# EAGLE schematic ARE_adaptadores_v101 (EAGLE 6.1)

## Sheet 1 of 11: dsPIC / 24F / PIC32 64pin
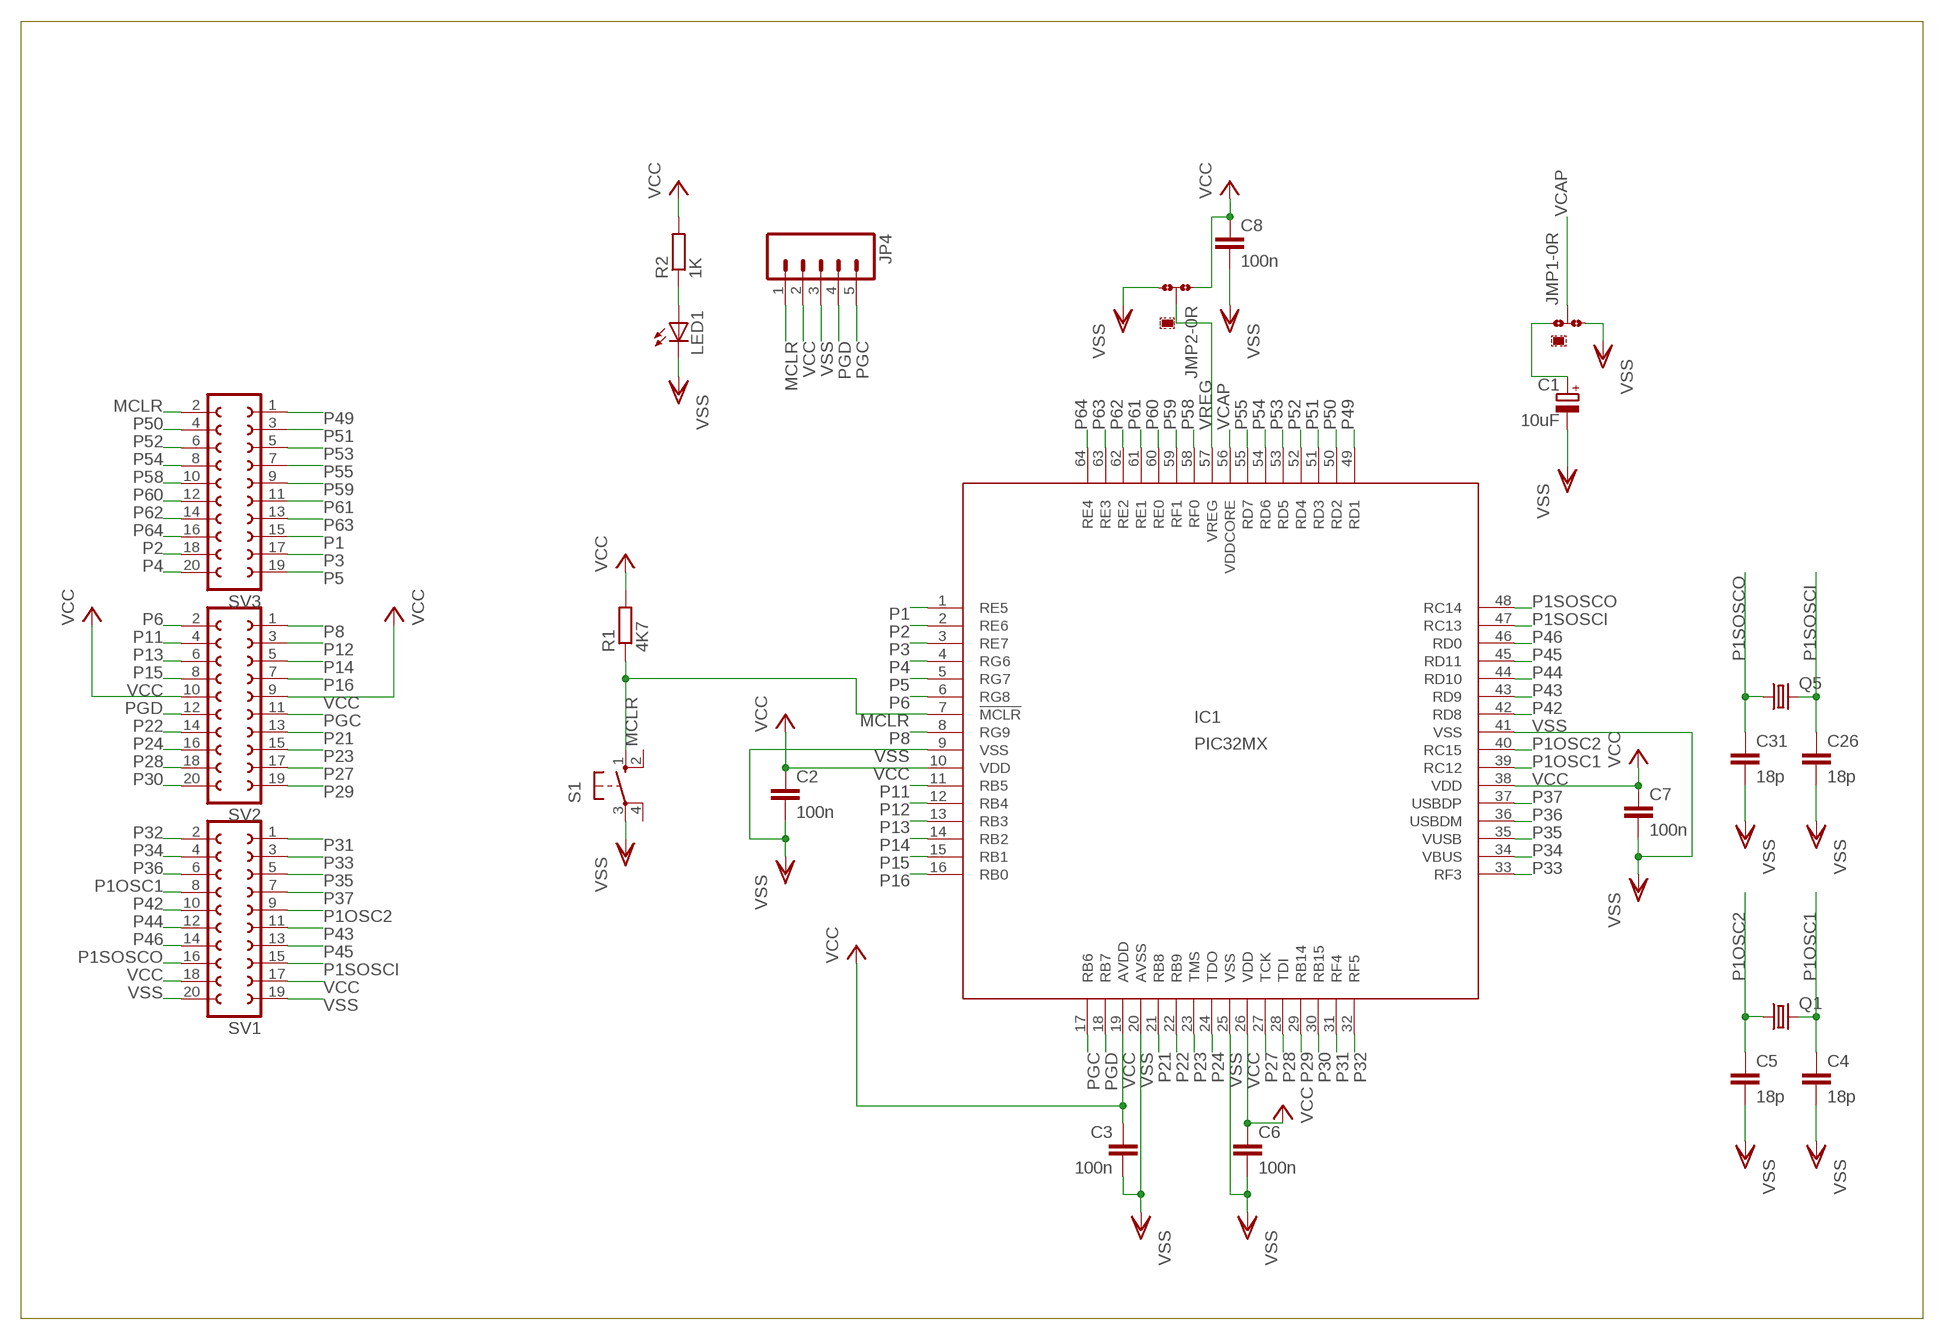
[diagram p0: schematic, sheet 1]

### Parts
C1  10uF  CPOL-EUSMCC  [SMC_C]
C2  100n  C-EUC0805  [C0805]
C3  100n  C-EUC0805  [C0805]
C4  18p  C-EUC0805  [C0805]
C5  18p  C-EUC0805  [C0805]
C6  100n  C-EUC0805  [C0805]
C7  100n  C-EUC0805  [C0805]
C8  100n  C-EUC0805  [C0805]
C26  18p  C-EUC0805  [C0805]
C31  18p  C-EUC0805  [C0805]
IC1  PIC32MX  PIC32MX440F256H  [TQFP64-10X10]
JMP1  0R-JUMPA  [A0R-JMP]
JMP2  0R-JUMPA  [A0R-JMP]
JP4  M05PTH  [1X05]
LED1  LEDCHIPLED_0805  [CHIPLED_0805]
Q1  CRYSTALHC18U-V  [HC18U-V]
Q5  CRYSTALHC18U-V  [HC18U-V]
R1  4K7  R-EU_R0805  [R0805]
R2  1K  R-EU_R0805  [R0805]
S1  10-XX  [B3F-10XX]
SV1  FE10-2W  [FE10-2W]
SV2  FE10-2W  [FE10-2W]
SV3  FE10-2W  [FE10-2W]

### Nets
MCLR: IC1.7(!MCLR) JP4.1 R1.1 S1.1(S) SV3.2
N$1: LED1.A R2.1
N$5: C1.+ JMP1.1
P1: IC1.1(RE5) SV3.15
P1OSC1: C4.1 IC1.39(RC12) Q1.2 SV1.8
P1OSC2: C5.1 IC1.40(RC15) Q1.1 SV1.9
P1SOSCI: C26.1 IC1.47(RC13) Q5.2 SV1.15
P1SOSCO: C31.1 IC1.48(RC14) Q5.1 SV1.16
P2: IC1.2(RE6) SV3.18
P3: IC1.3(RE7) SV3.17
P4: IC1.4(RG6) SV3.20
P5: IC1.5(RG7) SV3.19
P6: IC1.6(RG8) SV2.2
P8: IC1.8(RG9) SV2.1
P11: IC1.11(RB5) SV2.4
P12: IC1.12(RB4) SV2.3
P13: IC1.13(RB3) SV2.6
P14: IC1.14(RB2) SV2.5
P15: IC1.15(RB1) SV2.8
P16: IC1.16(RB0) SV2.7
P21: IC1.21(RB8) SV2.13
P22: IC1.22(RB9) SV2.14
P23: IC1.23(TMS) SV2.15
P24: IC1.24(TDO) SV2.16
P27: IC1.27(TCK) SV2.17
P28: IC1.28(TDI) SV2.18
P29: IC1.29(RB14) SV2.19
P30: IC1.30(RB15) SV2.20
P31: IC1.31(RF4) SV1.1
P32: IC1.32(RF5) SV1.2
P33: IC1.33(RF3) SV1.3
P34: IC1.34(VBUS) SV1.4
P35: IC1.35(VUSB) SV1.5
P36: IC1.36(USBDM) SV1.6
P37: IC1.37(USBDP) SV1.7
P42: IC1.42(RD8) SV1.10
P43: IC1.43(RD9) SV1.11
P44: IC1.44(RD10) SV1.12
P45: IC1.45(RD11) SV1.13
P46: IC1.46(RD0) SV1.14
P49: IC1.49(RD1) SV3.1
P50: IC1.50(RD2) SV3.4
P51: IC1.51(RD3) SV3.3
P52: IC1.52(RD4) SV3.6
P53: IC1.53(RD5) SV3.5
P54: IC1.54(RD6) SV3.8
P55: IC1.55(RD7) SV3.7
P58: IC1.58(RF0) SV3.10
P59: IC1.59(RF1) SV3.9
P60: IC1.60(RE0) SV3.12
P61: IC1.61(RE1) SV3.11
P62: IC1.62(RE2) SV3.14
P63: IC1.63(RE3) SV3.13
P64: IC1.64(RE4) SV3.16
PGC: IC1.17(RB6) JP4.5 SV2.11
PGD: IC1.18(RB7) JP4.4 SV2.12
VCAP: IC1.56(VDDCORE) JMP1.2
VCC: C2.1 C3.1 C6.1 C7.1 C8.1 IC1.10(VDD) IC1.19(AVDD) IC1.26(VDD) IC1.38(VDD) JMP2.1 JP4.2 R1.2 R2.2 SV1.17 SV1.18 SV2.9 SV2.10 ; also sheet 2,3,4,5,6
VREG: IC1.57(VREG) JMP2.2
VSS: C1.- C2.2 C3.2 C4.2 C5.2 C6.2 C7.2 C8.2 C26.2 C31.2 IC1.9(VSS) IC1.20(AVSS) IC1.25(VSS) IC1.41(VSS) JMP1.3 JMP2.3 JP4.3 LED1.C S1.3(P) SV1.19 SV1.20 ; also sheet 2,3,4,5,6,7,8,9,10,11
Unconnected: S1.2(S1) S1.4(P1)

## Sheet 2 of 11: dsPIC / 24F / PIC32 44 pin
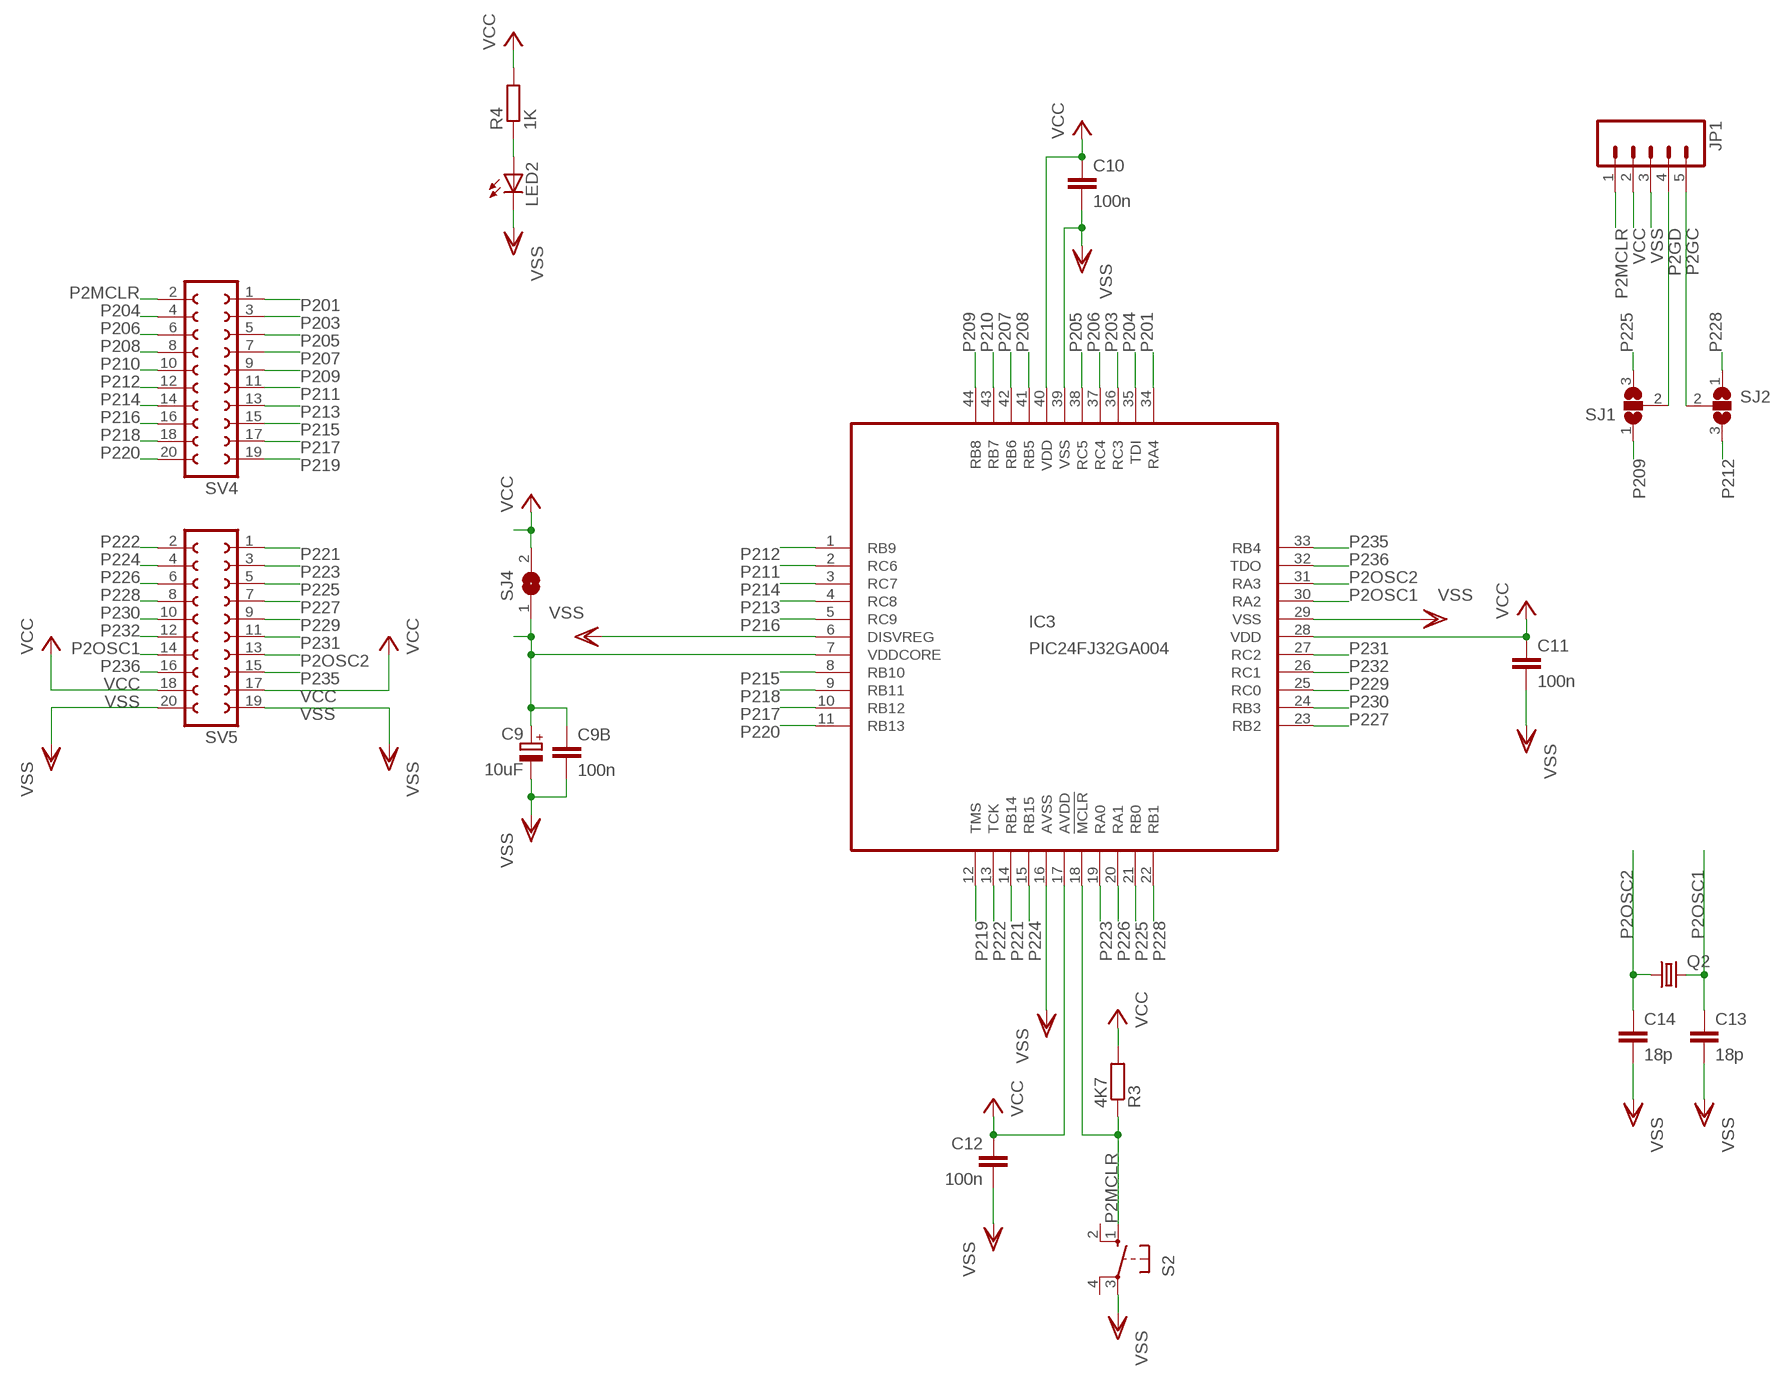
[diagram p1: schematic, sheet 2]

### Parts
C9  10uF  CPOL-EUSMCC  [SMC_C]
C9B  100n  C-EUC0805  [C0805]
C10  100n  C-EUC0805  [C0805]
C11  100n  C-EUC0805  [C0805]
C12  100n  C-EUC0805  [C0805]
C13  18p  C-EUC0805  [C0805]
C14  18p  C-EUC0805  [C0805]
IC3  PIC24FJ32GA004  [TQFP44]
JP1  M05PTH  [1X05]
LED2  LEDCHIPLED_0805  [CHIPLED_0805]
Q2  CRYSTALHC18U-V  [HC18U-V]
R3  4K7  R-EU_R0805  [R0805]
R4  1K  R-EU_R0805  [R0805]
S2  10-XX  [B3F-10XX]
SJ1  SJ2W  [SJ_2]
SJ2  SJ2W  [SJ_2]
SJ4  SJ  [SJ]
SV4  FE10-2W  [FE10-2W]
SV5  FE10-2W  [FE10-2W]

### Nets
N$2: LED2.A R4.1
N$11: C9.+ C9B.1 IC3.7(VDDCORE) SJ4.1
P2GC: JP1.5 SJ2.2
P2GD: JP1.4 SJ1.2
P2MCLR: IC3.18(!MCLR) JP1.1 R3.1 S2.1(S) SV4.2
P2OSC1: C13.1 IC3.30(RA2) Q2.2 SV5.14
P2OSC2: C14.1 IC3.31(RA3) Q2.1 SV5.13
P201: IC3.34(RA4) SV4.1
P203: IC3.36(RC3) SV4.3
P204: IC3.35(TDI) SV4.4
P205: IC3.38(RC5) SV4.5
P206: IC3.37(RC4) SV4.6
P207: IC3.42(RB6) SV4.7
P208: IC3.41(RB5) SV4.8
P209: IC3.44(RB8) SJ1.1 SV4.9
P210: IC3.43(RB7) SV4.10
P211: IC3.2(RC6) SV4.11
P212: IC3.1(RB9) SJ2.3 SV4.12
P213: IC3.4(RC8) SV4.13
P214: IC3.3(RC7) SV4.14
P215: IC3.8(RB10) SV4.15
P216: IC3.5(RC9) SV4.16
P217: IC3.10(RB12) SV4.17
P218: IC3.9(RB11) SV4.18
P219: IC3.12(TMS) SV4.19
P220: IC3.11(RB13) SV4.20
P221: IC3.14(RB14) SV5.1
P222: IC3.13(TCK) SV5.2
P223: IC3.19(RA0) SV5.3
P224: IC3.15(RB15) SV5.4
P225: IC3.21(RB0) SJ1.3 SV5.5
P226: IC3.20(RA1) SV5.6
P227: IC3.23(RB2) SV5.7
P228: IC3.22(RB1) SJ2.1 SV5.8
P229: IC3.25(RC0) SV5.9
P230: IC3.24(RB3) SV5.10
P231: IC3.27(RC2) SV5.11
P232: IC3.26(RC1) SV5.12
P235: IC3.33(RB4) SV5.15
P236: IC3.32(TDO) SV5.16
VCC: C10.1 C11.1 C12.1 IC3.17(AVDD) IC3.28(VDD) IC3.40(VDD) JP1.2 R3.2 R4.2 SJ4.2 SV5.17 SV5.18 ; also sheet 1,3,4,5,6
VSS: C9.- C9B.2 C10.2 C11.2 C12.2 C13.2 C14.2 IC3.6(DISVREG) IC3.16(AVSS) IC3.29(VSS) IC3.39(VSS) JP1.3 LED2.C S2.3(P) SV5.19 SV5.20 ; also sheet 1,3,4,5,6,7,8,9,10,11
Unconnected: S2.2(S1) S2.4(P1)

## Sheet 3 of 11: dsPIC 28pin
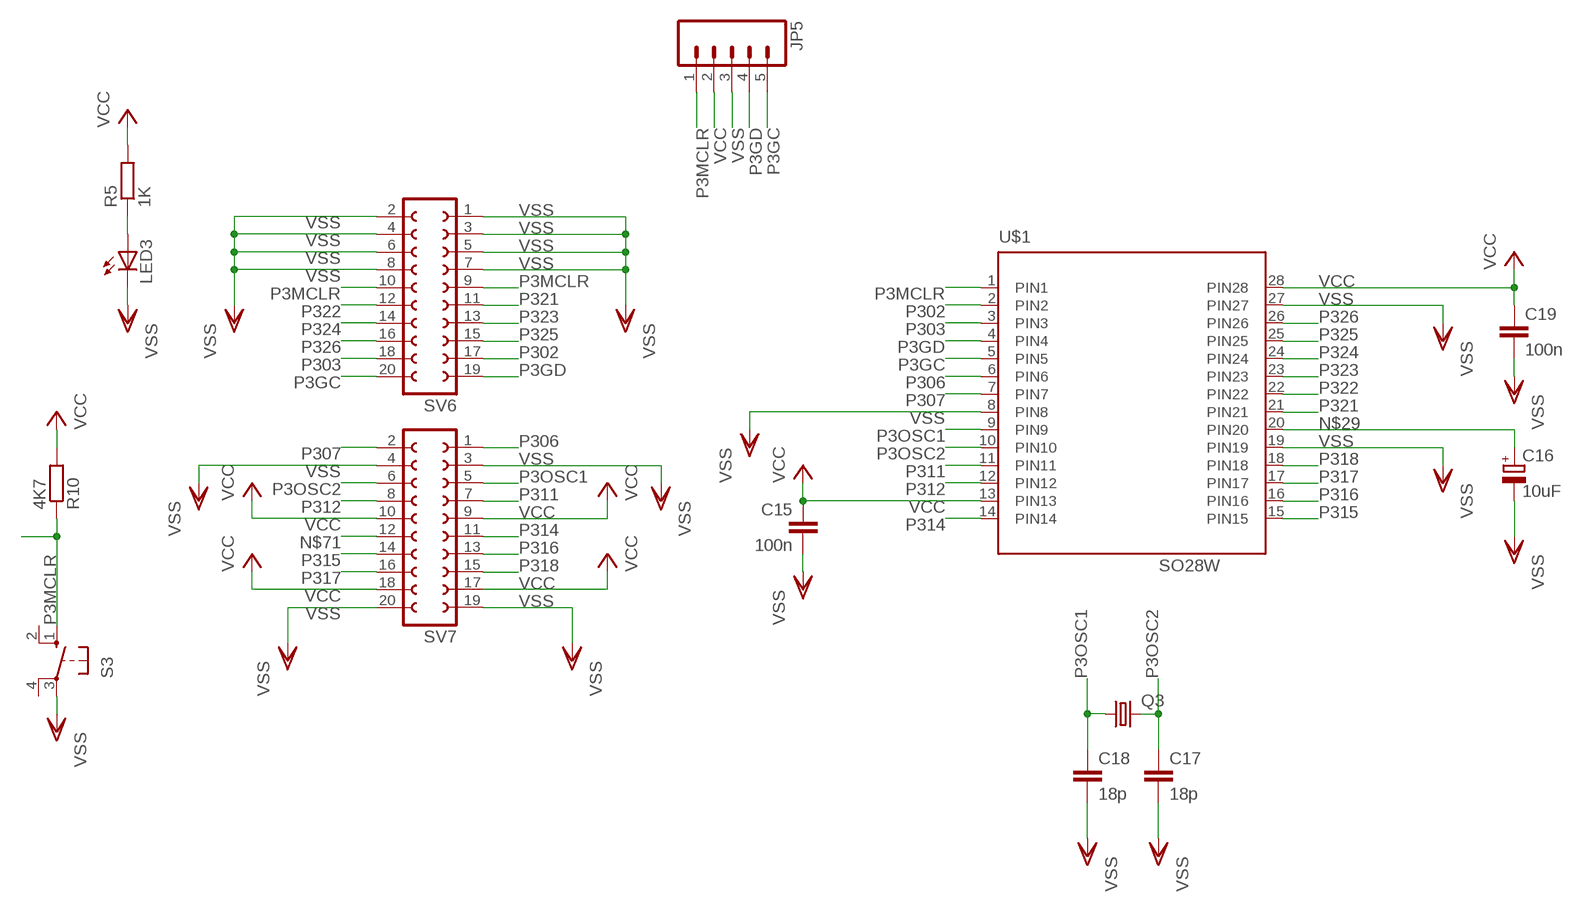
[diagram p2: schematic, sheet 3]

### Parts
C15  100n  C-EUC0805  [C0805]
C16  10uF  CPOL-EUSMCC  [SMC_C]
C17  18p  C-EUC0805  [C0805]
C18  18p  C-EUC0805  [C0805]
C19  100n  C-EUC0805  [C0805]
JP5  M05PTH  [1X05]
LED3  LEDCHIPLED_0805  [CHIPLED_0805]
Q3  CRYSTALHC18U-V  [HC18U-V]
R5  1K  R-EU_R0805  [R0805]
R10  4K7  R-EU_R0805  [R0805]
S3  10-XX  [B3F-10XX]
SV6  FE10-2W  [FE10-2W]
SV7  FE10-2W  [FE10-2W]
U$1  SO28W  [SO28W]

### Nets
N$3: LED3.A R5.1
N$29: C16.+ U$1.20(PIN20)
N$71: SV7.12
P3GC: JP5.5 SV6.20 U$1.5(PIN5)
P3GD: JP5.4 SV6.19 U$1.4(PIN4)
P3MCLR: JP5.1 R10.1 S3.1(S) SV6.9 SV6.10 U$1.1(PIN1)
P3OSC1: C18.1 Q3.1 SV7.5 U$1.9(PIN9)
P3OSC2: C17.1 Q3.2 SV7.6 U$1.10(PIN10)
P302: SV6.17 U$1.2(PIN2)
P303: SV6.18 U$1.3(PIN3)
P306: SV7.1 U$1.6(PIN6)
P307: SV7.2 U$1.7(PIN7)
P311: SV7.7 U$1.11(PIN11)
P312: SV7.8 U$1.12(PIN12)
P314: SV7.11 U$1.14(PIN14)
P315: SV7.14 U$1.15(PIN15)
P316: SV7.13 U$1.16(PIN16)
P317: SV7.16 U$1.17(PIN17)
P318: SV7.15 U$1.18(PIN18)
P321: SV6.11 U$1.21(PIN21)
P322: SV6.12 U$1.22(PIN22)
P323: SV6.13 U$1.23(PIN23)
P324: SV6.14 U$1.24(PIN24)
P325: SV6.15 U$1.25(PIN25)
P326: SV6.16 U$1.26(PIN26)
VCC: C15.1 C19.1 JP5.2 R5.2 R10.2 SV7.9 SV7.10 SV7.17 SV7.18 U$1.13(PIN13) U$1.28(PIN28) ; also sheet 1,2,4,5,6
VSS: C15.2 C16.- C17.2 C18.2 C19.2 JP5.3 LED3.C S3.3(P) SV6.1 SV6.2 SV6.3 SV6.4 SV6.5 SV6.6 SV6.7 SV6.8 SV7.3 SV7.4 SV7.19 SV7.20 U$1.8(PIN8) U$1.19(PIN19) U$1.27(PIN27) ; also sheet 1,2,4,5,6,7,8,9,10,11
Unconnected: S3.2(S1) S3.4(P1)

## Sheet 4 of 11: PIC 16F / 18F 44 pin
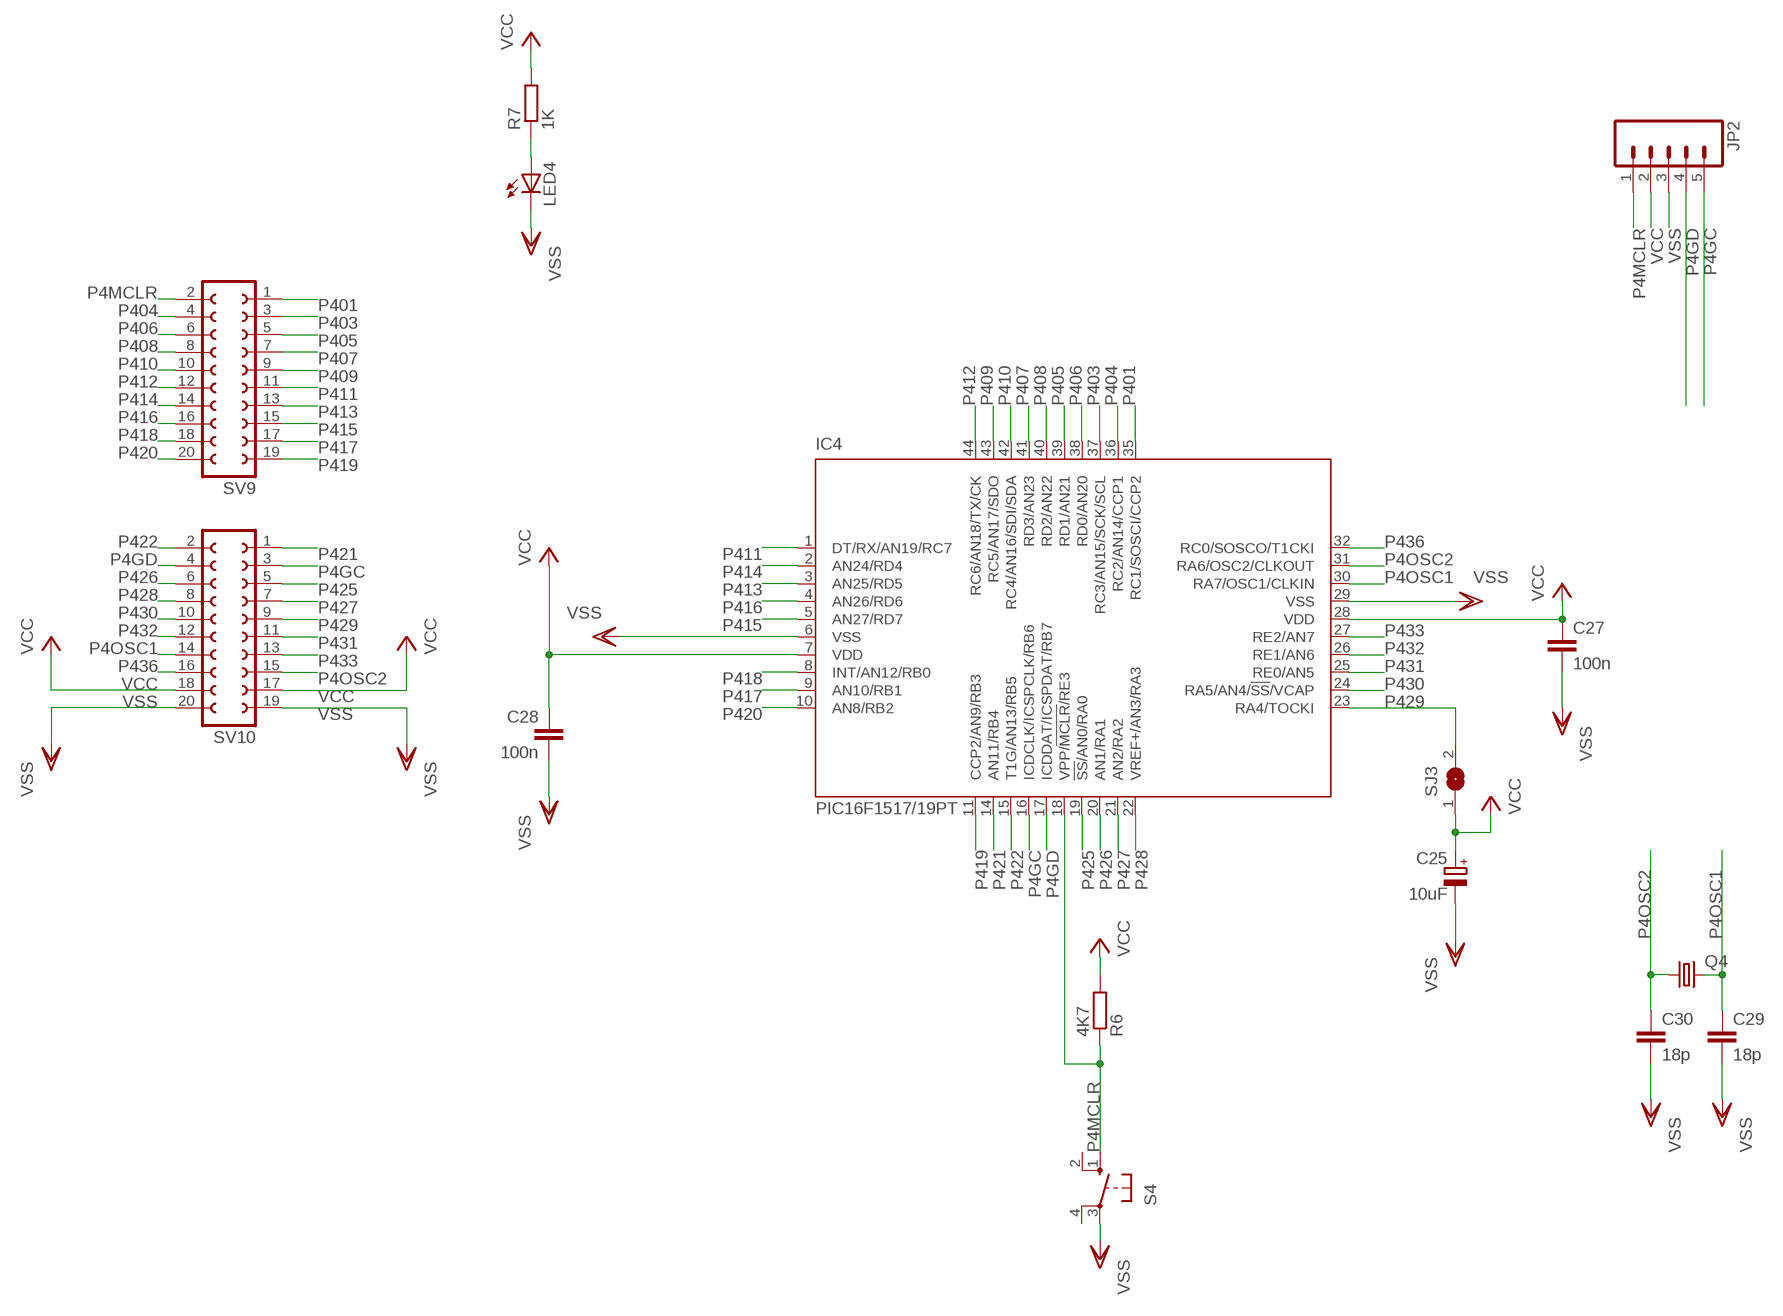
[diagram p3: schematic, sheet 4]

### Parts
C25  10uF  CPOL-EUSMCC  [SMC_C]
C27  100n  C-EUC0805  [C0805]
C28  100n  C-EUC0805  [C0805]
C29  18p  C-EUC0805  [C0805]
C30  18p  C-EUC0805  [C0805]
IC4  PIC16F1517/19PT  [TQFP44]
JP2  M05PTH  [1X05]
LED4  LEDCHIPLED_0805  [CHIPLED_0805]
Q4  CRYSTALHC18U-V  [HC18U-V]
R6  4K7  R-EU_R0805  [R0805]
R7  1K  R-EU_R0805  [R0805]
S4  10-XX  [B3F-10XX]
SJ3  SJ  [SJ]
SV9  FE10-2W  [FE10-2W]
SV10  FE10-2W  [FE10-2W]

### Nets
N$4: LED4.A R7.1
P4GC: IC4.16(ICDCLK/ICSPCLK/RB6) JP2.5 SV10.3
P4GD: IC4.17(ICDDAT/ICSPDAT/RB7) JP2.4 SV10.4
P4MCLR: IC4.18(VPP/!MCLR!/RE3) JP2.1 R6.1 S4.1(S) SV9.2
P4OSC1: C29.1 IC4.30(RA7/OSC1/CLKIN) Q4.2 SV10.14
P4OSC2: C30.1 IC4.31(RA6/OSC2/CLKOUT) Q4.1 SV10.15
P401: IC4.35(RC1/SOSCI/CCP2) SV9.1
P403: IC4.37(RC3/AN15/SCK/SCL) SV9.3
P404: IC4.36(RC2/AN14/CCP1) SV9.4
P405: IC4.39(RD1/AN21) SV9.5
P406: IC4.38(RD0/AN20) SV9.6
P407: IC4.41(RD3/AN23) SV9.7
P408: IC4.40(RD2/AN22) SV9.8
P409: IC4.43(RC5/AN17/SDO) SV9.9
P410: IC4.42(RC4/AN16/SDI/SDA) SV9.10
P411: IC4.1(DT/RX/AN19/RC7) SV9.11
P412: IC4.44(RC6/AN18/TX/CK) SV9.12
P413: IC4.3(AN25/RD5) SV9.13
P414: IC4.2(AN24/RD4) SV9.14
P415: IC4.5(AN27/RD7) SV9.15
P416: IC4.4(AN26/RD6) SV9.16
P417: IC4.9(AN10/RB1) SV9.17
P418: IC4.8(INT/AN12/RB0) SV9.18
P419: IC4.11(CCP2/AN9/RB3) SV9.19
P420: IC4.10(AN8/RB2) SV9.20
P421: IC4.14(AN11/RB4) SV10.1
P422: IC4.15(T1G/AN13/RB5) SV10.2
P425: IC4.19(!SS!/AN0/RA0) SV10.5
P426: IC4.20(AN1/RA1) SV10.6
P427: IC4.21(AN2/RA2) SV10.7
P428: IC4.22(VREF+/AN3/RA3) SV10.8
P429: IC4.23(RA4/TOCKI) SJ3.2 SV10.9
P430: IC4.24(RA5/AN4/!SS!/VCAP) SV10.10
P431: IC4.25(RE0/AN5) SV10.11
P432: IC4.26(RE1/AN6) SV10.12
P433: IC4.27(RE2/AN7) SV10.13
P436: IC4.32(RC0/SOSCO/T1CKI) SV10.16
VCC: C25.+ C27.1 C28.1 IC4.7(VDD) IC4.28(VDD) JP2.2 R6.2 R7.2 SJ3.1 SV10.17 SV10.18 ; also sheet 1,2,3,5,6
VSS: C25.- C27.2 C28.2 C29.2 C30.2 IC4.6(VSS) IC4.29(VSS) JP2.3 LED4.C S4.3(P) SV10.19 SV10.20 ; also sheet 1,2,3,5,6,7,8,9,10,11
Unconnected: S4.2(S1) S4.4(P1)

## Sheet 5 of 11: PIC 10F / 12F / 16F 8pin / 14pin
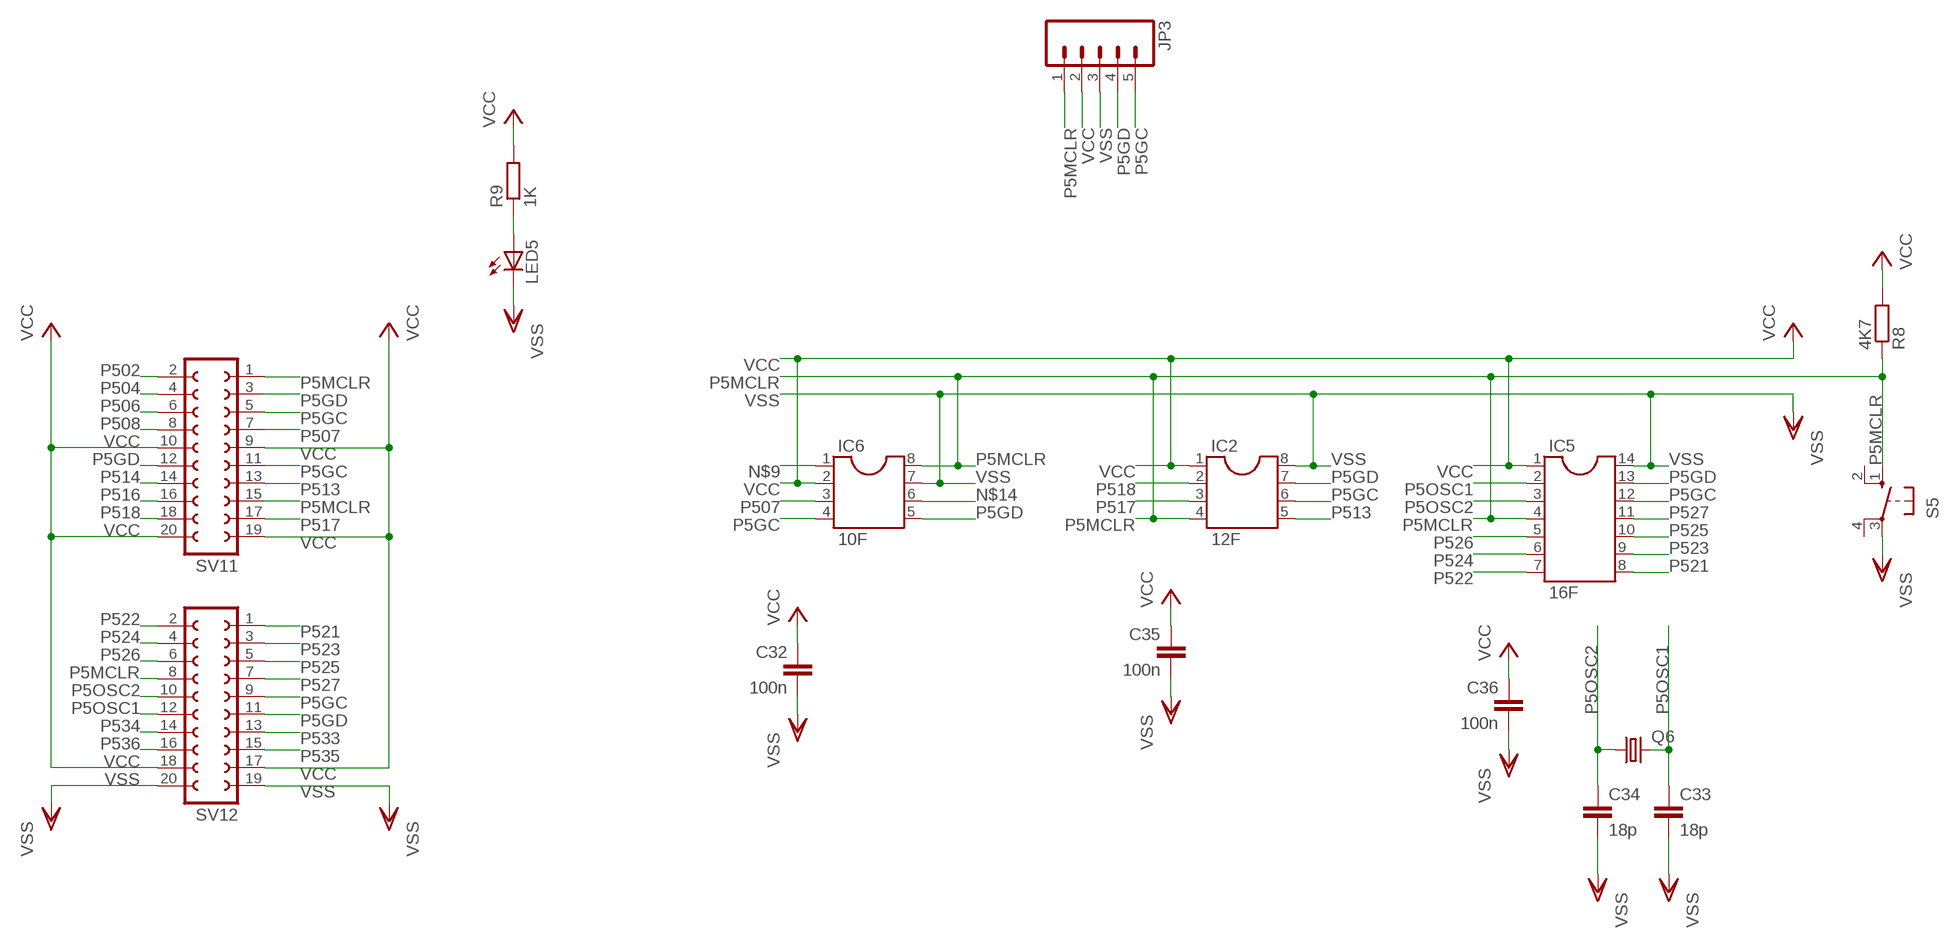
[diagram p4: schematic, sheet 5]

### Parts
C32  100n  C-EUC0805  [C0805]
C33  18p  C-EUC0805  [C0805]
C34  18p  C-EUC0805  [C0805]
C35  100n  C-EUC0805  [C0805]
C36  100n  C-EUC0805  [C0805]
IC2  12F  DIL8S  [SOCKET-08]
IC5  16F  DIL14S  [SOCKET-14]
IC6  10F  DIL8S  [SOCKET-08]
JP3  M05PTH  [1X05]
LED5  LEDCHIPLED_0805  [CHIPLED_0805]
Q6  CRYSTALHC18U-V  [HC18U-V]
R8  4K7  R-EU_R0805  [R0805]
R9  1K  R-EU_R0805  [R0805]
S5  10-XX  [B3F-10XX]
SV11  FE10-2W  [FE10-2W]
SV12  FE10-2W  [FE10-2W]

### Nets
N$8: LED5.A R9.1
N$9: IC6.1
N$14: IC6.6
P5GC: IC2.6 IC5.12 IC6.4 JP3.5 SV11.5 SV11.11 SV12.9
P5GD: IC2.7 IC5.13 IC6.5 JP3.4 SV11.3 SV11.12 SV12.11
P5MCLR: IC2.4 IC5.4 IC6.8 JP3.1 R8.1 S5.1(S) SV11.1 SV11.15 SV12.8
P5OSC1: C33.1 IC5.2 Q6.2 SV12.12
P5OSC2: C34.1 IC5.3 Q6.1 SV12.10
P502: SV11.2
P504: SV11.4
P506: SV11.6
P507: IC6.3 SV11.7
P508: SV11.8
P513: IC2.5 SV11.13
P514: SV11.14
P516: SV11.16
P517: IC2.3 SV11.17
P518: IC2.2 SV11.18
P521: IC5.8 SV12.1
P522: IC5.7 SV12.2
P523: IC5.9 SV12.3
P524: IC5.6 SV12.4
P525: IC5.10 SV12.5
P526: IC5.5 SV12.6
P527: IC5.11 SV12.7
P533: SV12.13
P534: SV12.14
P535: SV12.15
P536: SV12.16
VCC: C32.1 C35.1 C36.1 IC2.1 IC5.1 IC6.2 JP3.2 R8.2 R9.2 SV11.9 SV11.10 SV11.19 SV11.20 SV12.17 SV12.18 ; also sheet 1,2,3,4,6
VSS: C32.2 C33.2 C34.2 C35.2 C36.2 IC2.8 IC5.14 IC6.7 JP3.3 LED5.C S5.3(P) SV12.19 SV12.20 ; also sheet 1,2,3,4,6,7,8,9,10,11
Unconnected: S5.2(S1) S5.4(P1)

## Sheet 6 of 11: dsPIC30F4011 QFN 8x8
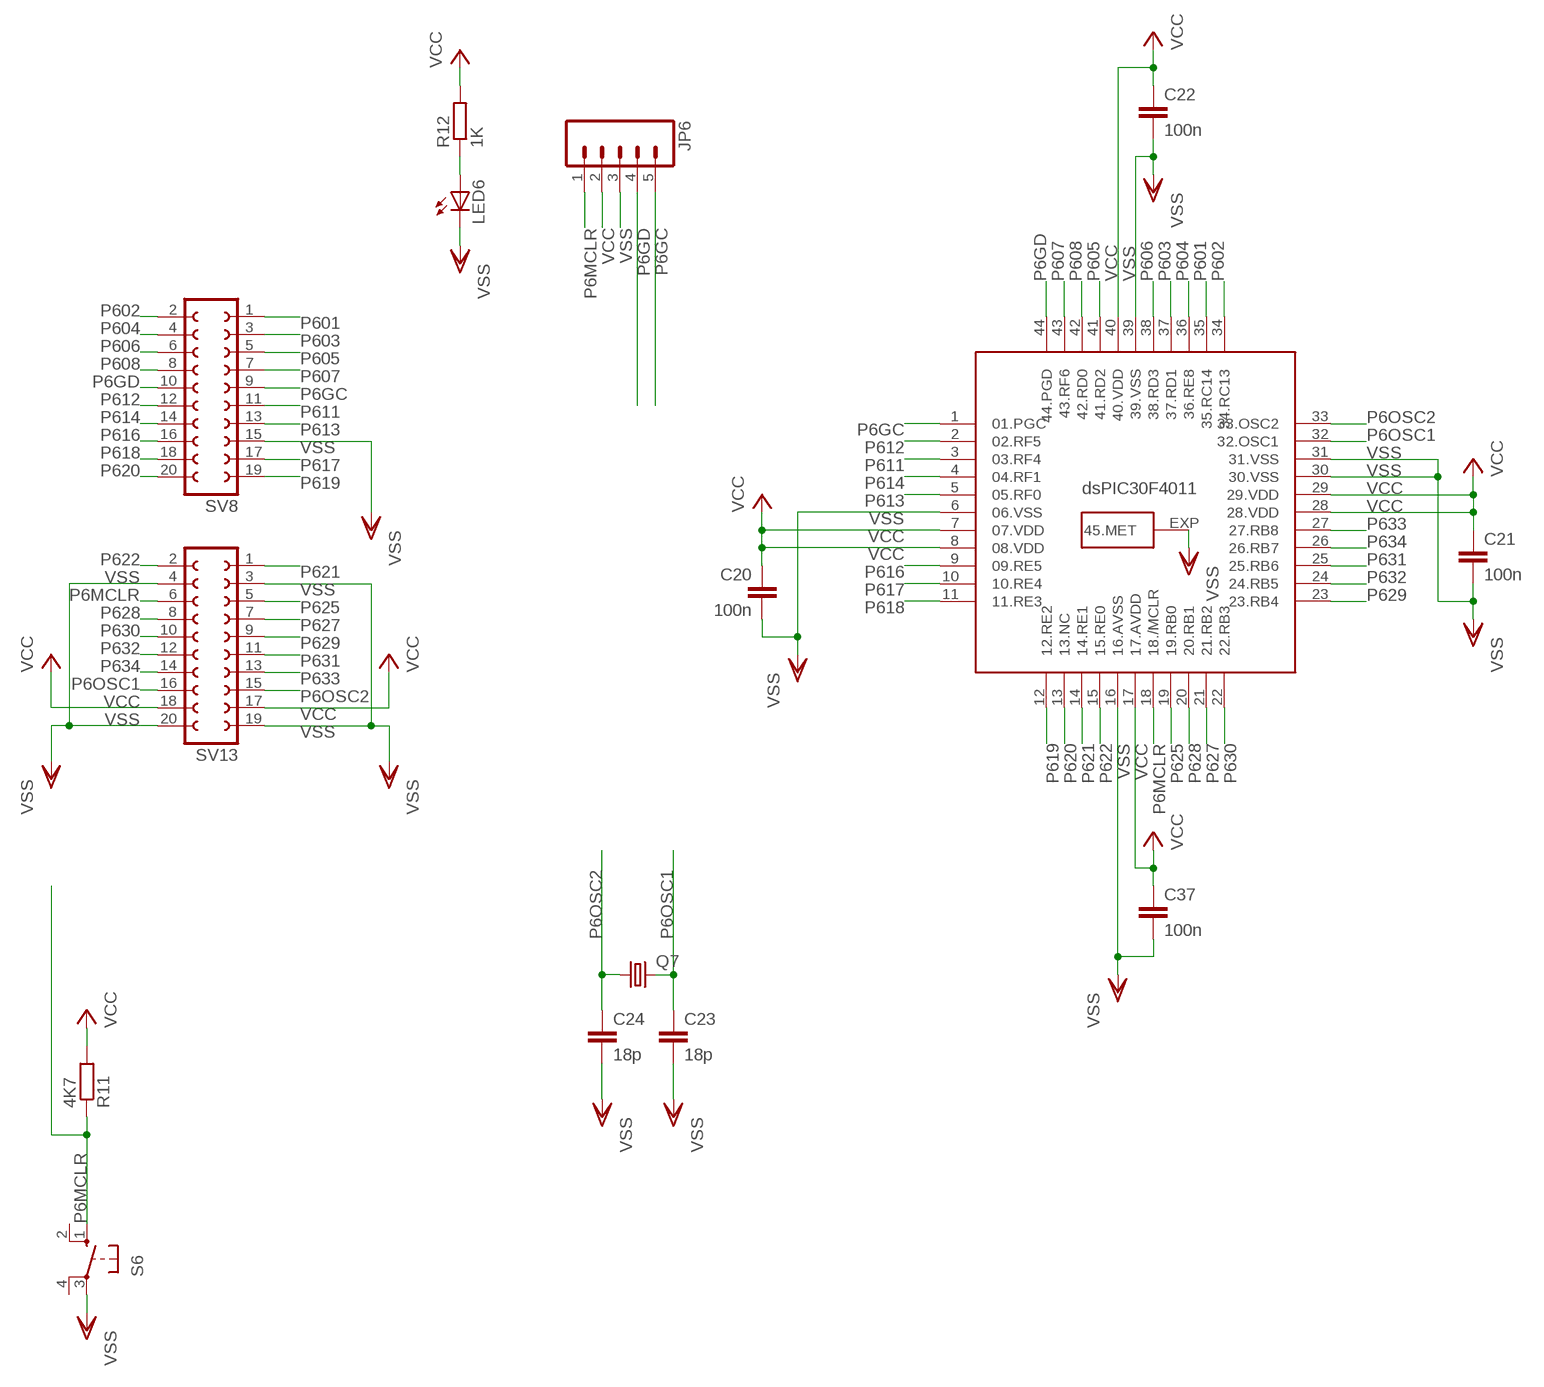
[diagram p5: schematic, sheet 6]

### Parts
C20  100n  C-EUC0805  [C0805]
C21  100n  C-EUC0805  [C0805]
C22  100n  C-EUC0805  [C0805]
C23  18p  C-EUC0805  [C0805]
C24  18p  C-EUC0805  [C0805]
C37  100n  C-EUC0805  [C0805]
JP6  M05PTH  [1X05]
LED6  LEDCHIPLED_0805  [CHIPLED_0805]
Q7  CRYSTALHC18U-V  [HC18U-V]
R11  4K7  R-EU_R0805  [R0805]
R12  1K  R-EU_R0805  [R0805]
S6  10-XX  [B3F-10XX]
SV8  FE10-2W  [FE10-2W]
SV13  FE10-2W  [FE10-2W]
U$2  DSPIC30F4011  [QFN44ML8X8]

### Nets
N$6: LED6.A R12.1
P6GC: JP6.5 SV8.9 U$2.1(01.PGC)
P6GD: JP6.4 SV8.10 U$2.44(44.PGD)
P6MCLR: JP6.1 R11.1 S6.1(S) SV13.6 U$2.18(18./MCLR)
P6OSC1: C23.1 Q7.2 SV13.16 U$2.32(32.OSC1)
P6OSC2: C24.1 Q7.1 SV13.15 U$2.33(33.OSC2)
P601: SV8.1 U$2.35(35.RC14)
P602: SV8.2 U$2.34(34.RC13)
P603: SV8.3 U$2.37(37.RD1)
P604: SV8.4 U$2.36(36.RE8)
P605: SV8.5 U$2.41(41.RD2)
P606: SV8.6 U$2.38(38.RD3)
P607: SV8.7 U$2.43(43.RF6)
P608: SV8.8 U$2.42(42.RD0)
P611: SV8.11 U$2.3(03.RF4)
P612: SV8.12 U$2.2(02.RF5)
P613: SV8.13 U$2.5(05.RF0)
P614: SV8.14 U$2.4(04.RF1)
P616: SV8.16 U$2.9(09.RE5)
P617: SV8.17 U$2.10(10.RE4)
P618: SV8.18 U$2.11(11.RE3)
P619: SV8.19 U$2.12(12.RE2)
P620: SV8.20 U$2.13(13.NC)
P621: SV13.1 U$2.14(14.RE1)
P622: SV13.2 U$2.15(15.RE0)
P625: SV13.5 U$2.19(19.RB0)
P627: SV13.7 U$2.21(21.RB2)
P628: SV13.8 U$2.20(20.RB1)
P629: SV13.9 U$2.23(23.RB4)
P630: SV13.10 U$2.22(22.RB3)
P631: SV13.11 U$2.25(25.RB6)
P632: SV13.12 U$2.24(24.RB5)
P633: SV13.13 U$2.27(27.RB8)
P634: SV13.14 U$2.26(26.RB7)
VCC: C20.1 C21.1 C22.1 C37.1 JP6.2 R11.2 R12.2 SV13.17 SV13.18 U$2.7(07.VDD) U$2.8(08.VDD) U$2.17(17.AVDD) U$2.28(28.VDD) U$2.29(29.VDD) U$2.40(40.VDD) ; also sheet 1,2,3,4,5
VSS: C20.2 C21.2 C22.2 C23.2 C24.2 C37.2 JP6.3 LED6.C S6.3(P) SV8.15 SV13.3 SV13.4 SV13.19 SV13.20 U$2.6(06.VSS) U$2.16(16.AVSS) U$2.30(30.VSS) U$2.31(31.VSS) U$2.39(39.VSS) U$2.EXP(45.MET) ; also sheet 1,2,3,4,5,7,8,9,10,11
Unconnected: S6.2(S1) S6.4(P1)

## Sheet 7 of 11: AT90-8515 40 pin DIP
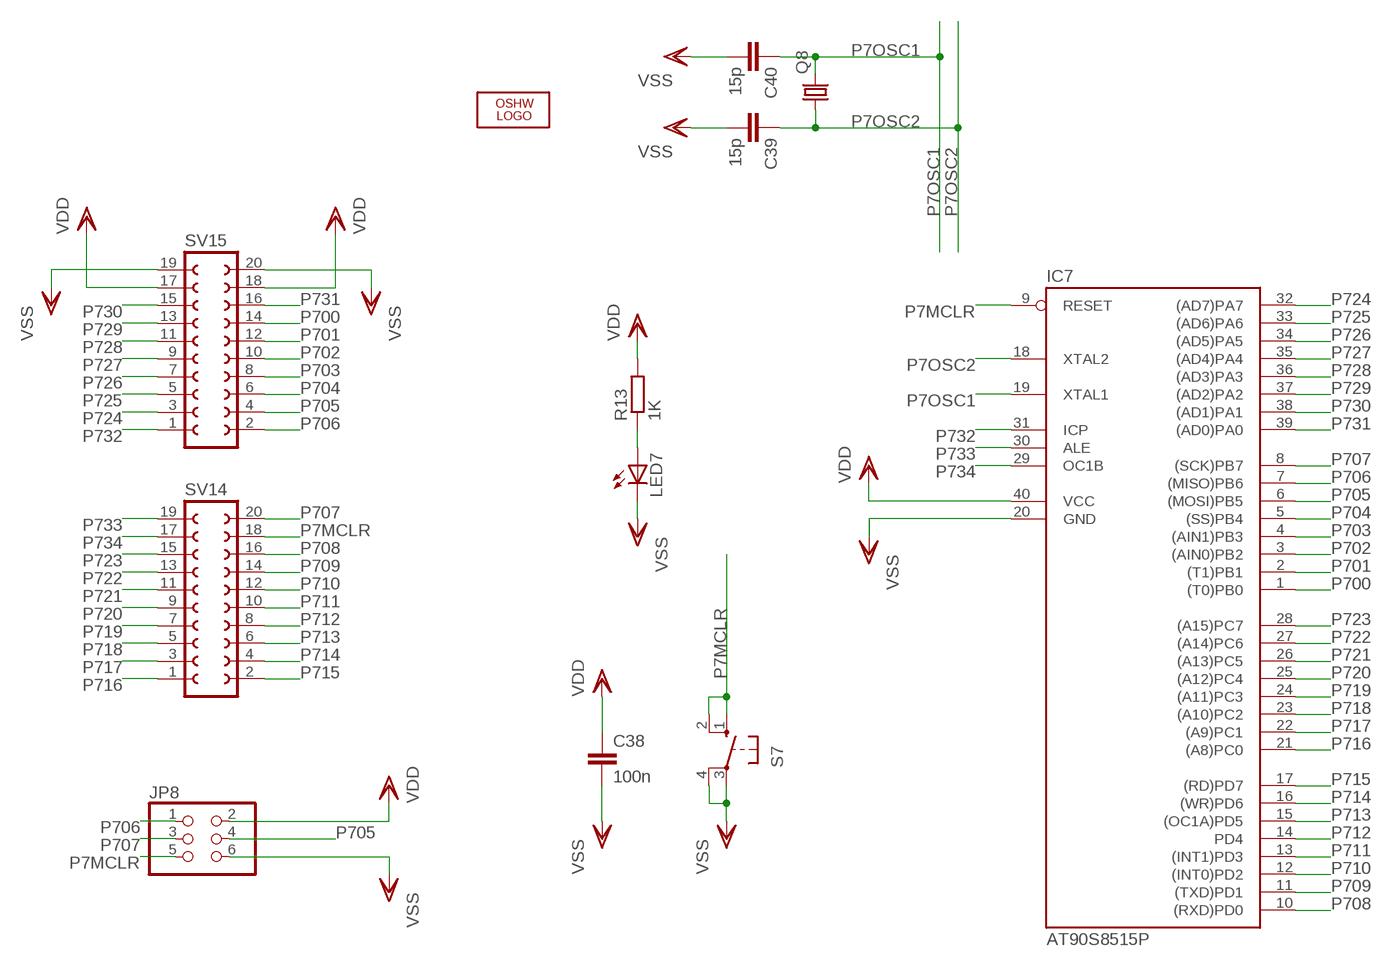
[diagram p6: schematic, sheet 7]

### Parts
C38  100n  C-EUC0805  [C0805]
C39  15p  C-EUC0805  [C0805]
C40  15p  C-EUC0805  [C0805]
IC7  AT90S8515P  [DIL40]
JP8  PINHD-2X3  [2X03]
LED7  LED3MM  [LED3MM]
LOGO2  OSHW_LOGO_8MILX0150-NT  [OSHW_8X150_NOTEXT]
Q8  CRYSTALHC18U-V  [HC18U-V]
R13  1K  R-EU_R0805  [R0805]
S7  10-XX  [B3F-10XX]
SV14  FE10-2W  [FE10-2W]
SV15  FE10-2W  [FE10-2W]

### Nets
N$7: LED7.A R13.1
P7MCLR: IC7.9(RESET) JP8.5 S7.1(S) S7.2(S1) SV14.18
P7OSC1: C40.1 IC7.19(XTAL1) Q8.2
P7OSC2: C39.1 IC7.18(XTAL2) Q8.1
P700: IC7.1((T0)PB0) SV15.14
P701: IC7.2((T1)PB1) SV15.12
P702: IC7.3((AIN0)PB2) SV15.10
P703: IC7.4((AIN1)PB3) SV15.8
P704: IC7.5((SS)PB4) SV15.6
P705: IC7.6((MOSI)PB5) JP8.4 SV15.4
P706: IC7.7((MISO)PB6) JP8.1 SV15.2
P707: IC7.8((SCK)PB7) JP8.3 SV14.20
P708: IC7.10((RXD)PD0) SV14.16
P709: IC7.11((TXD)PD1) SV14.14
P710: IC7.12((INT0)PD2) SV14.12
P711: IC7.13((INT1)PD3) SV14.10
P712: IC7.14(PD4) SV14.8
P713: IC7.15((OC1A)PD5) SV14.6
P714: IC7.16((WR)PD6) SV14.4
P715: IC7.17((RD)PD7) SV14.2
P716: IC7.21((A8)PC0) SV14.1
P717: IC7.22((A9)PC1) SV14.3
P718: IC7.23((A10)PC2) SV14.5
P719: IC7.24((A11)PC3) SV14.7
P720: IC7.25((A12)PC4) SV14.9
P721: IC7.26((A13)PC5) SV14.11
P722: IC7.27((A14)PC6) SV14.13
P723: IC7.28((A15)PC7) SV14.15
P724: IC7.32((AD7)PA7) SV15.3
P725: IC7.33((AD6)PA6) SV15.5
P726: IC7.34((AD5)PA5) SV15.7
P727: IC7.35((AD4)PA4) SV15.9
P728: IC7.36((AD3)PA3) SV15.11
P729: IC7.37((AD2)PA2) SV15.13
P730: IC7.38((AD1)PA1) SV15.15
P731: IC7.39((AD0)PA0) SV15.16
P732: IC7.31(ICP) SV15.1
P733: IC7.30(ALE) SV14.19
P734: IC7.29(OC1B) SV14.17
VDD: C38.1 IC7.40(VCC) JP8.2 R13.2 SV15.17 SV15.18 ; also sheet 8,9,10,11
VSS: C38.2 C39.2 C40.2 IC7.20(GND) JP8.6 LED7.K(C) S7.3(P) S7.4(P1) SV15.19 SV15.20 ; also sheet 1,2,3,4,5,6,8,9,10,11

## Sheet 8 of 11: AT90-8535 40 pin DIP
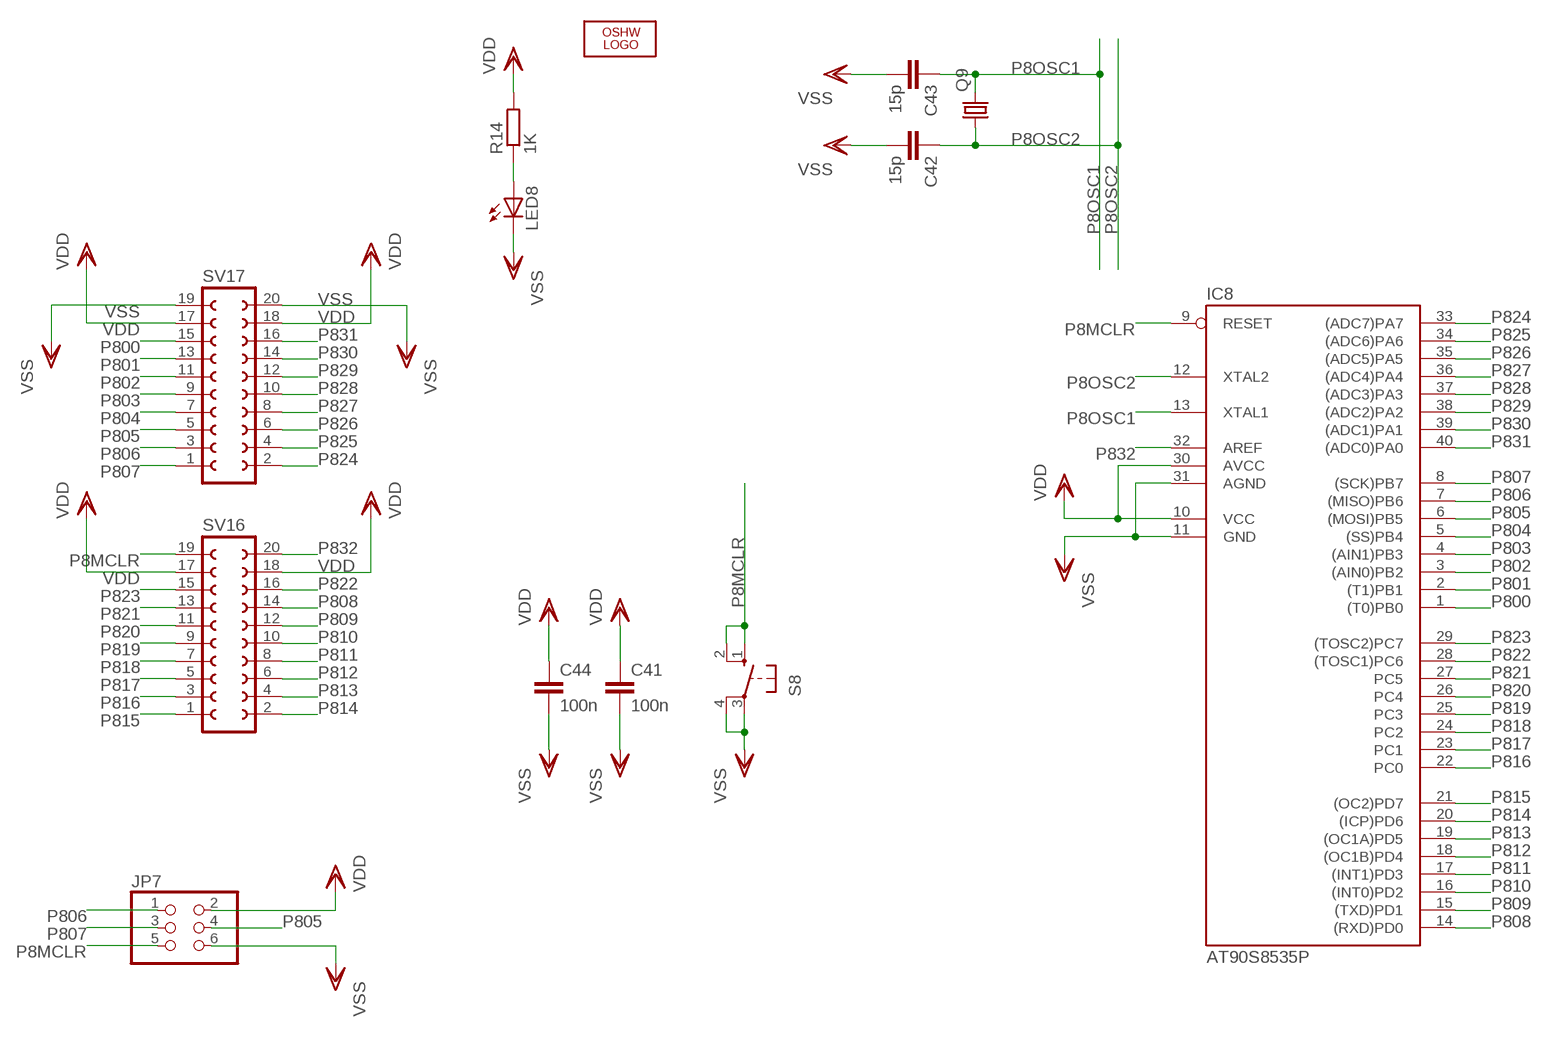
[diagram p7: schematic, sheet 8]

### Parts
C41  100n  C-EUC0805  [C0805]
C42  15p  C-EUC0805  [C0805]
C43  15p  C-EUC0805  [C0805]
C44  100n  C-EUC0805  [C0805]
IC8  AT90S8535P  [DIL40]
JP7  PINHD-2X3  [2X03]
LED8  LED3MM  [LED3MM]
LOGO4  OSHW_LOGO_8MILX0150-NT  [OSHW_8X150_NOTEXT]
Q9  CRYSTALHC18U-V  [HC18U-V]
R14  1K  R-EU_R0805  [R0805]
S8  10-XX  [B3F-10XX]
SV16  FE10-2W  [FE10-2W]
SV17  FE10-2W  [FE10-2W]

### Nets
N$10: LED8.A R14.1
P8MCLR: IC8.9(RESET) JP7.5 S8.1(S) S8.2(S1) SV16.19
P8OSC1: C43.1 IC8.13(XTAL1) Q9.2
P8OSC2: C42.1 IC8.12(XTAL2) Q9.1
P800: IC8.1((T0)PB0) SV17.15
P801: IC8.2((T1)PB1) SV17.13
P802: IC8.3((AIN0)PB2) SV17.11
P803: IC8.4((AIN1)PB3) SV17.9
P804: IC8.5((SS)PB4) SV17.7
P805: IC8.6((MOSI)PB5) JP7.4 SV17.5
P806: IC8.7((MISO)PB6) JP7.1 SV17.3
P807: IC8.8((SCK)PB7) JP7.3 SV17.1
P808: IC8.14((RXD)PD0) SV16.14
P809: IC8.15((TXD)PD1) SV16.12
P810: IC8.16((INT0)PD2) SV16.10
P811: IC8.17((INT1)PD3) SV16.8
P812: IC8.18((OC1B)PD4) SV16.6
P813: IC8.19((OC1A)PD5) SV16.4
P814: IC8.20((ICP)PD6) SV16.2
P815: IC8.21((OC2)PD7) SV16.1
P816: IC8.22(PC0) SV16.3
P817: IC8.23(PC1) SV16.5
P818: IC8.24(PC2) SV16.7
P819: IC8.25(PC3) SV16.9
P820: IC8.26(PC4) SV16.11
P821: IC8.27(PC5) SV16.13
P822: IC8.28((TOSC1)PC6) SV16.16
P823: IC8.29((TOSC2)PC7) SV16.15
P824: IC8.33((ADC7)PA7) SV17.2
P825: IC8.34((ADC6)PA6) SV17.4
P826: IC8.35((ADC5)PA5) SV17.6
P827: IC8.36((ADC4)PA4) SV17.8
P828: IC8.37((ADC3)PA3) SV17.10
P829: IC8.38((ADC2)PA2) SV17.12
P830: IC8.39((ADC1)PA1) SV17.14
P831: IC8.40((ADC0)PA0) SV17.16
P832: IC8.32(AREF) SV16.20
VDD: C41.1 C44.1 IC8.10(VCC) IC8.30(AVCC) JP7.2 R14.2 SV16.17 SV16.18 SV17.17 SV17.18 ; also sheet 7,9,10,11
VSS: C41.2 C42.2 C43.2 C44.2 IC8.11(GND) IC8.31(AGND) JP7.6 LED8.K(C) S8.3(P) S8.4(P1) SV17.19 SV17.20 ; also sheet 1,2,3,4,5,6,7,9,10,11

## Sheet 9 of 11: 16F/18F 40 pin DIP
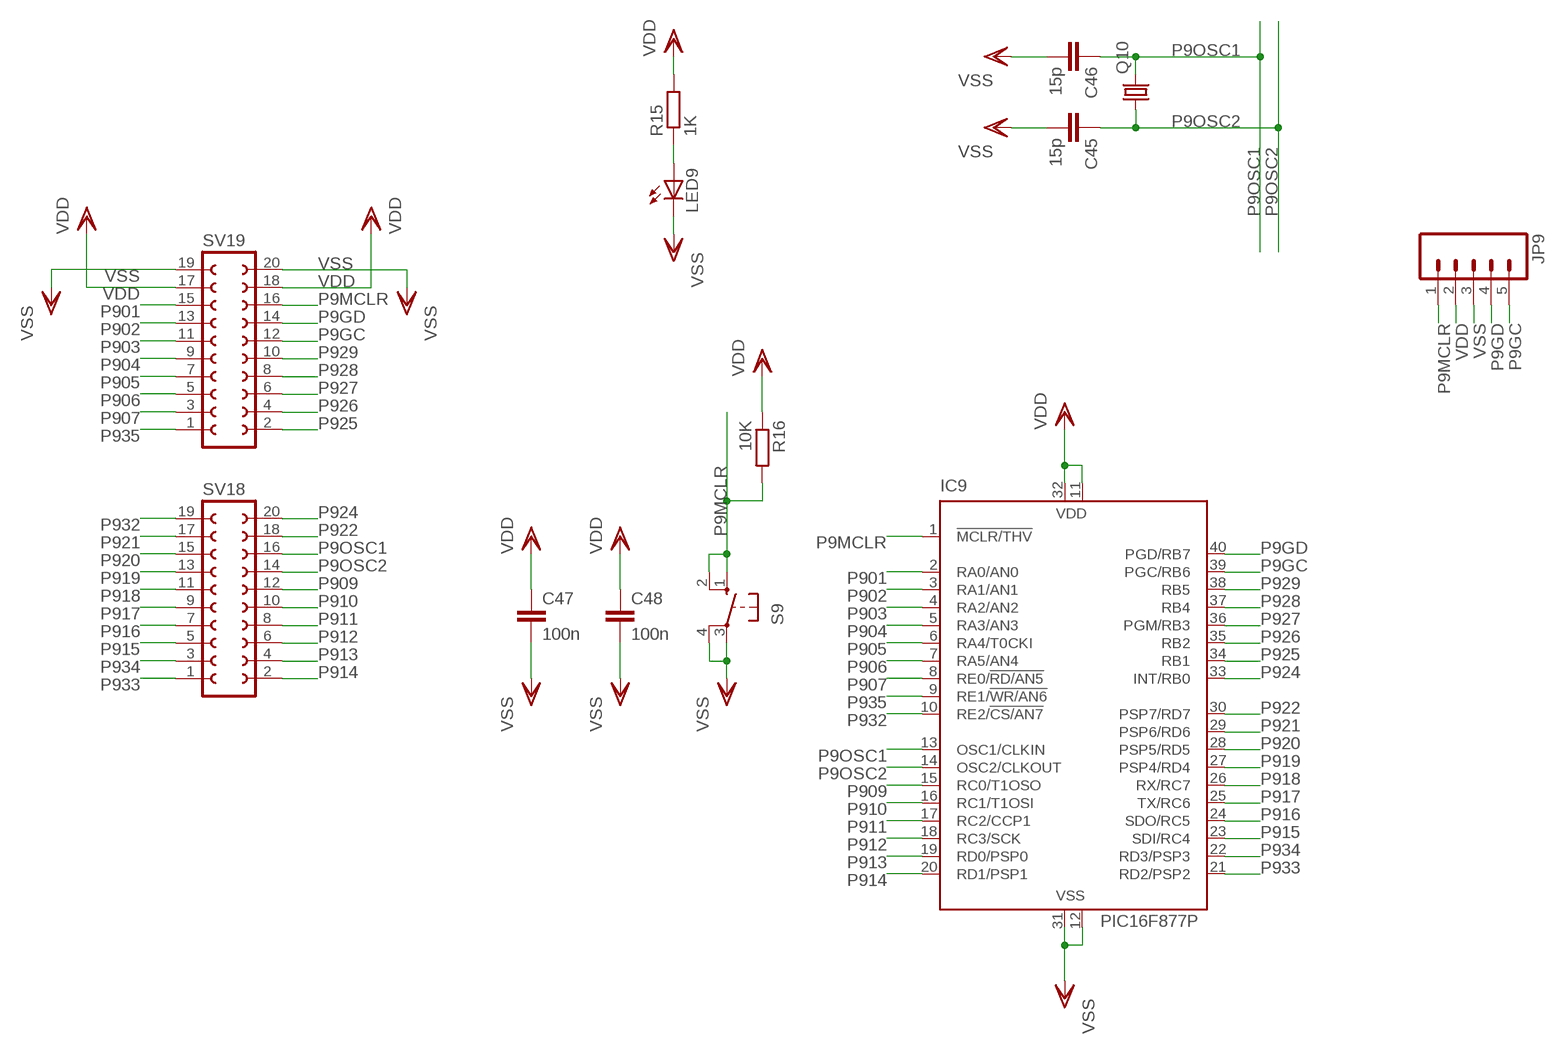
[diagram p8: schematic, sheet 9]

### Parts
C45  15p  C-EUC0805  [C0805]
C46  15p  C-EUC0805  [C0805]
C47  100n  C-EUC0805  [C0805]
C48  100n  C-EUC0805  [C0805]
IC9  PIC16F877P  [DIL40]
JP9  M05PTH  [1X05]
LED9  LED3MM  [LED3MM]
Q10  CRYSTALHC18U-V  [HC18U-V]
R15  1K  R-EU_R0805  [R0805]
R16  10K  R-EU_R0805  [R0805]
S9  10-XX  [B3F-10XX]
SV18  FE10-2W  [FE10-2W]
SV19  FE10-2W  [FE10-2W]

### Nets
N$12: LED9.A R15.1
P9GC: IC9.39(PGC/RB6) JP9.5 SV19.12
P9GD: IC9.40(PGD/RB7) JP9.4 SV19.14
P9MCLR: IC9.1(!MCLR/THV) JP9.1 R16.2 S9.1(S) S9.2(S1) SV19.16
P9OSC1: C46.1 IC9.13(OSC1/CLKIN) Q10.2 SV18.16
P9OSC2: C45.1 IC9.14(OSC2/CLKOUT) Q10.1 SV18.14
P901: IC9.2(RA0/AN0) SV19.15
P902: IC9.3(RA1/AN1) SV19.13
P903: IC9.4(RA2/AN2) SV19.11
P904: IC9.5(RA3/AN3) SV19.9
P905: IC9.6(RA4/T0CKI) SV19.7
P906: IC9.7(RA5/AN4) SV19.5
P907: IC9.8(RE0/!RD/AN5) SV19.3
P909: IC9.15(RC0/T1OSO) SV18.12
P910: IC9.16(RC1/T1OSI) SV18.10
P911: IC9.17(RC2/CCP1) SV18.8
P912: IC9.18(RC3/SCK) SV18.6
P913: IC9.19(RD0/PSP0) SV18.4
P914: IC9.20(RD1/PSP1) SV18.2
P915: IC9.23(SDI/RC4) SV18.5
P916: IC9.24(SDO/RC5) SV18.7
P917: IC9.25(TX/RC6) SV18.9
P918: IC9.26(RX/RC7) SV18.11
P919: IC9.27(PSP4/RD4) SV18.13
P920: IC9.28(PSP5/RD5) SV18.15
P921: IC9.29(PSP6/RD6) SV18.17
P922: IC9.30(PSP7/RD7) SV18.18
P924: IC9.33(INT/RB0) SV18.20
P925: IC9.34(RB1) SV19.2
P926: IC9.35(RB2) SV19.4
P927: IC9.36(PGM/RB3) SV19.6
P928: IC9.37(RB4) SV19.8
P929: IC9.38(RB5) SV19.10
P932: IC9.10(RE2/!CS/AN7) SV18.19
P933: IC9.21(RD2/PSP2) SV18.1
P934: IC9.22(RD3/PSP3) SV18.3
P935: IC9.9(RE1/!WR/AN6) SV19.1
VDD: C47.1 C48.1 IC9.11(VDD) IC9.32(VDD) JP9.2 R15.2 R16.1 SV19.17 SV19.18 ; also sheet 7,8,10,11
VSS: C45.2 C46.2 C47.2 C48.2 IC9.12(VSS) IC9.31(VSS) JP9.3 LED9.K(C) S9.3(P) S9.4(P1) SV19.19 SV19.20 ; also sheet 1,2,3,4,5,6,7,8,10,11

## Sheet 10 of 11: Propeller 40 pin DIP
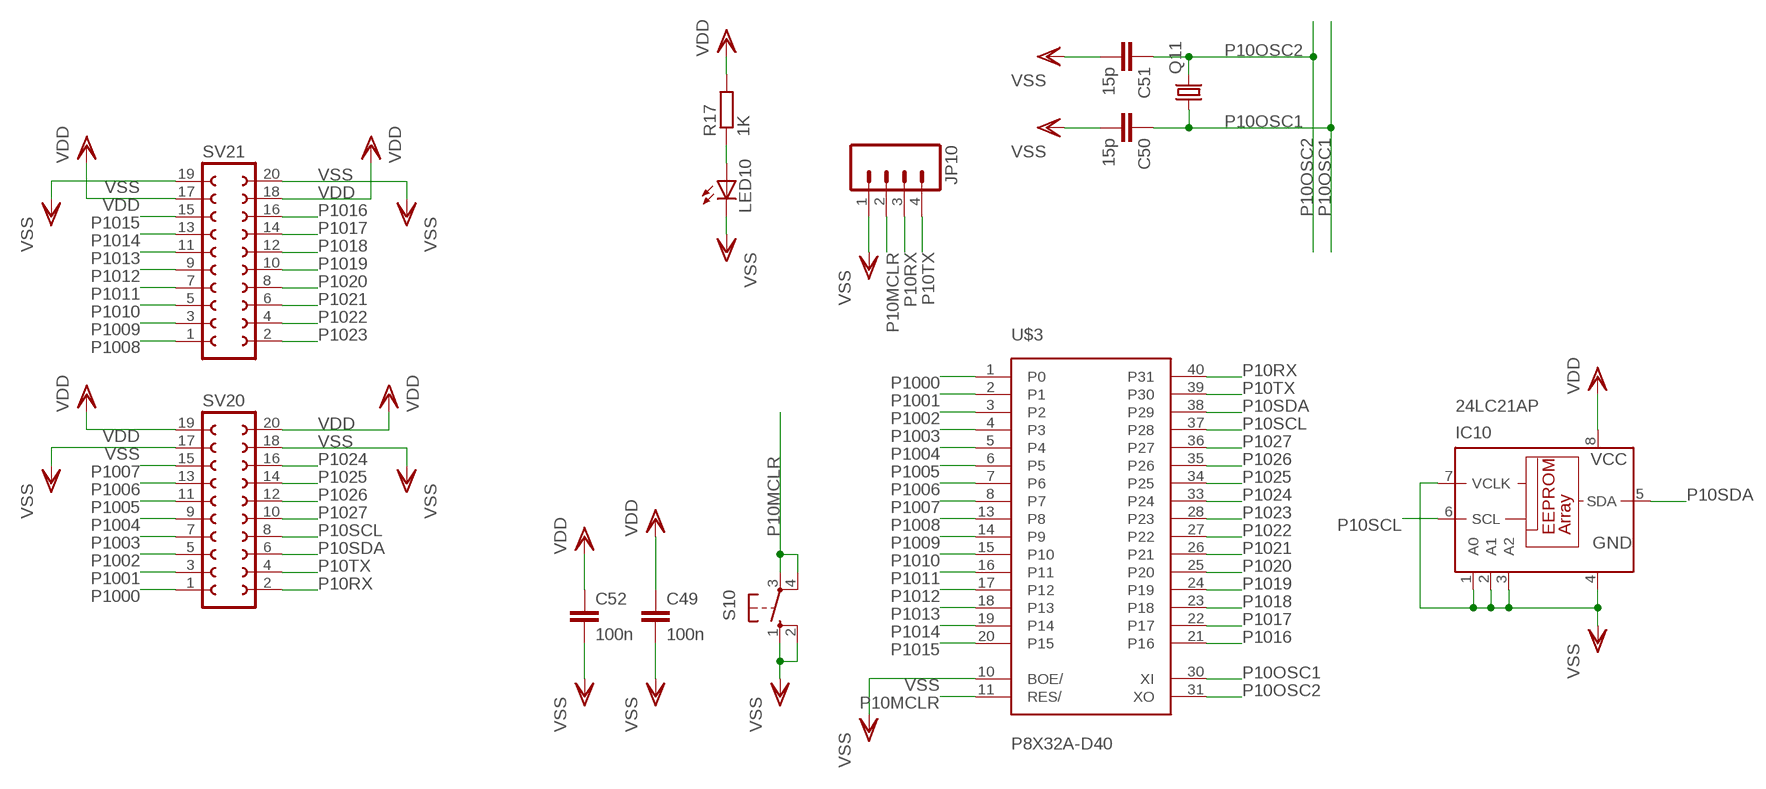
[diagram p9: schematic, sheet 10]

### Parts
C49  100n  C-EUC0805  [C0805]
C50  15p  C-EUC0805  [C0805]
C51  15p  C-EUC0805  [C0805]
C52  100n  C-EUC0805  [C0805]
IC10  24LC21AP  [DIL8]
JP10  M04PTH  [1X04]
LED10  LED3MM  [LED3MM]
Q11  CRYSTALHC18U-V  [HC18U-V]
R17  1K  R-EU_R0805  [R0805]
S10  10-XX  [B3F-10XX]
SV20  FE10-2W  [FE10-2W]
SV21  FE10-2W  [FE10-2W]
U$3  P8X32A-D40  [P8X32A-D40]

### Nets
N$13: LED10.A R17.1
P10MCLR: JP10.2 S10.3(P) S10.4(P1) U$3.11(RES/)
P10OSC1: C50.1 Q11.1 U$3.30(XI)
P10OSC2: C51.1 Q11.2 U$3.31(XO)
P10RX: JP10.3 SV20.2 U$3.40(P31)
P10SCL: IC10.6(SCL) SV20.8 U$3.37(P28)
P10SDA: IC10.5(SDA) SV20.6 U$3.38(P29)
P10TX: JP10.4 SV20.4 U$3.39(P30)
P1000: SV20.1 U$3.1(P0)
P1001: SV20.3 U$3.2(P1)
P1002: SV20.5 U$3.3(P2)
P1003: SV20.7 U$3.4(P3)
P1004: SV20.9 U$3.5(P4)
P1005: SV20.11 U$3.6(P5)
P1006: SV20.13 U$3.7(P6)
P1007: SV20.15 U$3.8(P7)
P1008: SV21.1 U$3.13(P8)
P1009: SV21.3 U$3.14(P9)
P1010: SV21.5 U$3.15(P10)
P1011: SV21.7 U$3.16(P11)
P1012: SV21.9 U$3.17(P12)
P1013: SV21.11 U$3.18(P13)
P1014: SV21.13 U$3.19(P14)
P1015: SV21.15 U$3.20(P15)
P1016: SV21.16 U$3.21(P16)
P1017: SV21.14 U$3.22(P17)
P1018: SV21.12 U$3.23(P18)
P1019: SV21.10 U$3.24(P19)
P1020: SV21.8 U$3.25(P20)
P1021: SV21.6 U$3.26(P21)
P1022: SV21.4 U$3.27(P22)
P1023: SV21.2 U$3.28(P23)
P1024: SV20.16 U$3.33(P24)
P1025: SV20.14 U$3.34(P25)
P1026: SV20.12 U$3.35(P26)
P1027: SV20.10 U$3.36(P27)
VDD: C49.1 C52.1 IC10.8(VCC) R17.2 SV20.19 SV20.20 SV21.17 SV21.18 ; also sheet 7,8,9,11
VSS: C49.2 C50.2 C51.2 C52.2 IC10.1(A0) IC10.2(A1) IC10.3(A2) IC10.4(GND) IC10.7(VCLK) JP10.1 LED10.K(C) S10.1(S) S10.2(S1) SV20.17 SV20.18 SV21.19 SV21.20 U$3.10(BOE/) ; also sheet 1,2,3,4,5,6,7,8,9,11

## Sheet 11 of 11: 16F/18F 28 pin DIP
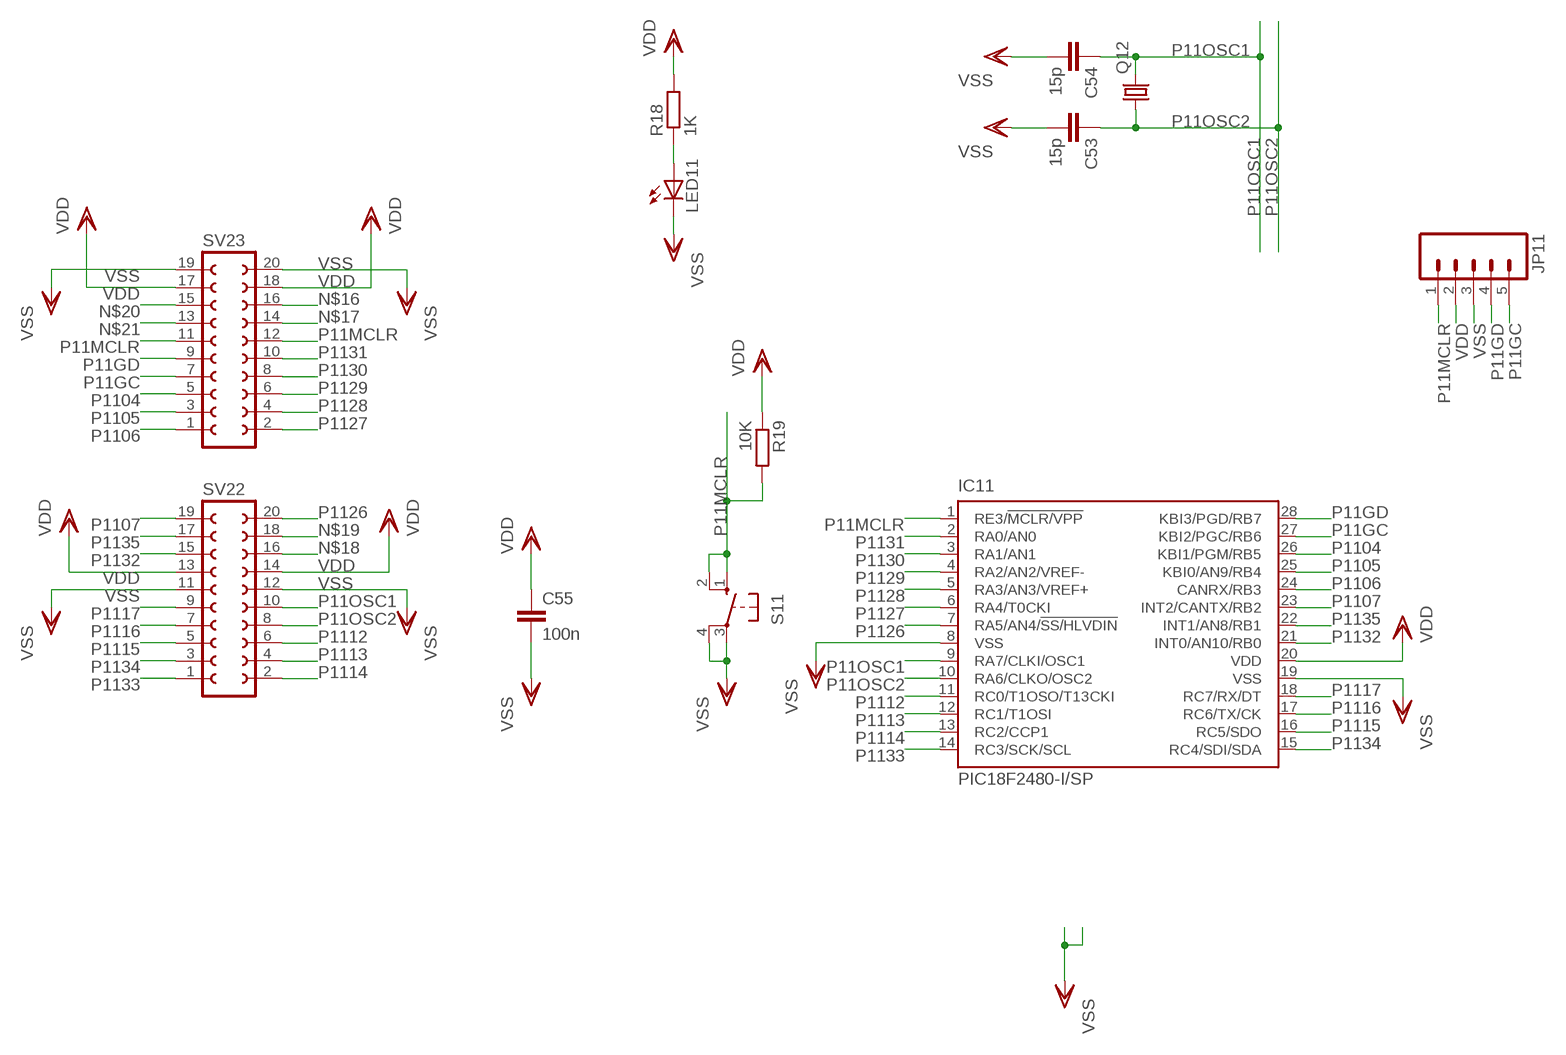
[diagram p10: schematic, sheet 11]

### Parts
C53  15p  C-EUC0805  [C0805]
C54  15p  C-EUC0805  [C0805]
C55  100n  C-EUC0805  [C0805]
IC11  PIC18F2480-I/SP  [DIL28-3]
JP11  M05PTH  [1X05]
LED11  LED3MM  [LED3MM]
Q12  CRYSTALHC18U-V  [HC18U-V]
R18  1K  R-EU_R0805  [R0805]
R19  10K  R-EU_R0805  [R0805]
S11  10-XX  [B3F-10XX]
SV22  FE10-2W  [FE10-2W]
SV23  FE10-2W  [FE10-2W]

### Nets
N$15: LED11.A R18.1
N$16: SV23.16
N$17: SV23.14
N$18: SV22.16
N$19: SV22.18
N$20: SV23.15
N$21: SV23.13
P11GC: IC11.27(KBI2/PGC/RB6) JP11.5 SV23.7
P11GD: IC11.28(KBI3/PGD/RB7) JP11.4 SV23.9
P11MCLR: IC11.1(RE3/!MCLR/VPP) JP11.1 R19.2 S11.1(S) S11.2(S1) SV23.11 SV23.12
P11OSC1: C54.1 IC11.9(RA7/CLKI/OSC1) Q12.2 SV22.10
P11OSC2: C53.1 IC11.10(RA6/CLKO/OSC2) Q12.1 SV22.8
P1104: IC11.26(KBI1/PGM/RB5) SV23.5
P1105: IC11.25(KBI0/AN9/RB4) SV23.3
P1106: IC11.24(CANRX/RB3) SV23.1
P1107: IC11.23(INT2/CANTX/RB2) SV22.19
P1112: IC11.11(RC0/T1OSO/T13CKI) SV22.6
P1113: IC11.12(RC1/T1OSI) SV22.4
P1114: IC11.13(RC2/CCP1) SV22.2
P1115: IC11.16(RC5/SDO) SV22.5
P1116: IC11.17(RC6/TX/CK) SV22.7
P1117: IC11.18(RC7/RX/DT) SV22.9
P1126: IC11.7(RA5/AN4/!SS/HLVDIN) SV22.20
P1127: IC11.6(RA4/T0CKI) SV23.2
P1128: IC11.5(RA3/AN3/VREF+) SV23.4
P1129: IC11.4(RA2/AN2/VREF-) SV23.6
P1130: IC11.3(RA1/AN1) SV23.8
P1131: IC11.2(RA0/AN0) SV23.10
P1132: IC11.21(INT0/AN10/RB0) SV22.15
P1133: IC11.14(RC3/SCK/SCL) SV22.1
P1134: IC11.15(RC4/SDI/SDA) SV22.3
P1135: IC11.22(INT1/AN8/RB1) SV22.17
VDD: C55.1 IC11.20(VDD) JP11.2 R18.2 R19.1 SV22.13 SV22.14 SV23.17 SV23.18 ; also sheet 7,8,9,10
VSS: C53.2 C54.2 C55.2 IC11.8(VSS) IC11.19(VSS) JP11.3 LED11.K(C) S11.3(P) S11.4(P1) SV22.11 SV22.12 SV23.19 SV23.20 ; also sheet 1,2,3,4,5,6,7,8,9,10

## Power pins joined to a net without a drawn wire
VDD: U$3.12(VDD) U$3.32(VDD)
VSS: U$3.9(VSS) U$3.29(VSS)

## Library data of the parts
C1 C9 C16 C25 = rcl:CPOL-EU: POLARIZED CAPACITOR, European symbol
C2-C8 C9B C10-C15 C17-C24 C26-C55 = rcl:C-EU: CAPACITOR, European symbol
IC1 = microchip_nuevo:PIC32MX440F256H: PIC32MX440F256H edit this description Auto generated by make-symbol-device-package-bsdl.ulp Rev. 25 Source: PIC32MX440F256H.bsdl
IC2 IC6 = ic-package:DIL8: Dual In Line / Socket
IC3 = microchip:PIC24FJ32GA004: PIC24FJ32GA004 edit this description Auto generated by make-symbol-device-package-bsdl.ulp Rev. 25 Source: PIC24FJ32GA004.bsd; MPN: PIC24FJ32GA004-E/PT; OC_FARNELL: 1332295; OC_NEWARK: 98M1915
IC4 = microchip:PIC16*F1517/19: 28/40/44-Pin Flash Microcontrollers with nanoWatt XLP Technology PIC16F1517/1519 AND PIC16LF1517/1519 Source: www.microchip.com PIC16F1516.pdf
IC5 = ic-package:DIL14: Dual In Line / Socket
IC7 = atmel:AT90S8515P: MICROCONTROLLER 8 Kbytes FLASH 512 bytes SRAM 512 bytes EEPROM UART
IC8 = atmel:AT90*8535P: MICROCONTROLLER 8 Kbytes FLASH 512 bytes SRAM 512 bytes EEPROM UART 8-channel 10 bit ADC
IC9 = microchip_nuevo:PIC16F87*: MICROCONTROLLER
IC10 = microchip_nuevo:24L*: Serial EEPROM 128 byte/1 K
IC11 = microchip:PIC18F2*80: 28-Pin Enhanced Flash Microcontrollers with ECAN(TM) Technology 10-Bit A/D and nanoWatt Technology Source: http://www.microchip.com .. 39637a.pdf; MF: MICROCHIP; MPN: PIC18F2480-I/SP; OC_FARNELL: 9321217; OC_NEWARK: 71J7237
JMP1 JMP2 = jump-0r-smd:0R-JUMP: SMD 0R 0805 Jumper
JP1-JP6 JP9 JP11 = SparkFun:M05: Header 5 Standard 5-pin 0.1" header. Use with straight break away headers (SKU : PRT-00116), right angle break away headers (PRT-00553), swiss pins (PRT-00743), machine pins (PRT-00117), and female headers (PRT-00115). Molex polarized connector foot print use with SKU : PRT-08230 with associated crimp pins and housings.
JP7 JP8 = pinhead:PINHD-2X3: PIN HEADER
JP10 = SparkFun:M04: Header 4 Standard 4-pin 0.1" header. Use with straight break away headers (SKU : PRT-00116), right angle break away headers (PRT-00553), swiss pins (PRT-00743), machine pins (PRT-00117), and female headers (PRT-00115). Molex polarized connector foot print use with SKU : PRT-08231 with associated crimp pins and housings. 1MM SMD Version SKU: PRT-10208
LED1-LED6 = led:LED: LED OSRAM: - CHIPLED LG R971, LG N971, LY N971, LG Q971, LY Q971, LO R971, LY R971 LH N974, LH R974 LS Q976, LO Q976, LY Q976 LO Q996 - Hyper CHIPLED LW Q18S LB Q993, LB Q99A, LB R99A - SideLED LS A670, LO A670, LY A670, LG A670, LP A670 LB A673, LV A673, LT A673, LW A673 LH A674 LY A675 LS A676, LA A676, LO A676, LY A676, LW A676 LS A679, LY A679, LG A679 - Hyper Micro SIDELED® LS Y876, LA Y876, LO Y876, LY Y876 LT Y87S - SmartLED LW L88C, LW L88S LB L89C, LB L89S, LG L890 LS L89K, LO L89K, LY L89K LS L896, LA L896, LO L896, LY L896 - TOPLED LS T670, LO T670, LY T670, LG T670, LP T670 LSG T670, LSP T670, LSY T670, LOP T670, LYG T670 LG T671, LOG T671, LSG T671 LB T673, LV T673, LT T673, LW T673 LH T674 LS T676, LA T676, LO T676, LY T676, LB T676, LH T676, LSB T676, LW T676 LB T67C, LV T67C, LT T67C, LS T67K, LO T67K, LY T67K, LW E67C LS E67B, LA E67B, LO E67B, LY E67B, LB E67C, LV E67C, LT E67C LW T67C LS T679, LY T679, LG T679 LS T770, LO T770, LY T770, LG T770, LP T770 LB T773, LV T773, LT T773, LW T773 LH T774 LS E675, LA E675, LY E675, LS T675 LS T776, LA T776, LO T776, LY T776, LB T776 LHGB T686 LT T68C, LB T68C - Hyper Mini TOPLED® LB M676 - Mini TOPLED Santana® LG M470 LS M47K, LO M47K, LY M47K Source: http://www.osram.convergy.de LUXEON: - LUMILED® LXK2-PW12-R00, LXK2-PW12-S00, LXK2-PW14-U00, LXK2-PW14-V00 LXK2-PM12-R00, LXK2-PM12-S00, LXK2-PM14-U00 LXK2-PE12-Q00, LXK2-PE12-R00, LXK2-PE12-S00, LXK2-PE14-T00, LXK2-PE14-U00 LXK2-PB12-K00, LXK2-PB12-L00, LXK2-PB12-M00, LXK2-PB14-N00, LXK2-PB14-P00, LXK2-PB14-Q00 LXK2-PR12-L00, LXK2-PR12-M00, LXK2-PR14-Q00, LXK2-PR14-R00 LXK2-PD12-Q00, LXK2-PD12-R00, LXK2-PD12-S00 LXK2-PH12-R00, LXK2-PH12-S00 LXK2-PL12-P00, LXK2-PL12-Q00, LXK2-PL12-R00 Source: www.luxeon.com KINGBRIGHT: KA-3528ASYC Source: www.kingbright.com
LED7-LED11 = SparkFun:LED: LEDs Standard schematic elements and footprints for 5mm, 3mm, 1206, and 0603 sized LEDs. 5mm - Spark Fun Electronics SKU : COM-00529 (and others)
LOGO2 LOGO4 = OSHW:OSHW_LOGO_8MIL
Q1-Q12 = crystal:CRYSTAL: CRYSTAL
R1-R19 = rcl:R-EU_: RESISTOR, European symbol
S1-S11 = switch-omron:10-XX: OMRON SWITCH; MPN: B3F-1000; OC_FARNELL: 176432; OC_NEWARK: 36M3542
SJ1 SJ2 = jumper:SJ2W: SMD solder JUMPER
SJ3 SJ4 = jumper:SJ: SMD solder JUMPER
SV1-SV23 = con-lsta:FE10-2W: FEMALE HEADER; OC_FARNELL: unknown; OC_NEWARK: unknown
U$1 = SMD:SO28W
U$2 = microchip:DSPIC30F4011
U$3 = parallax_propeller:P8X32A-D40